# EAGLE schematic keyboard (EAGLE 9.6.1)

## Sheet 1 of 2: Key connections
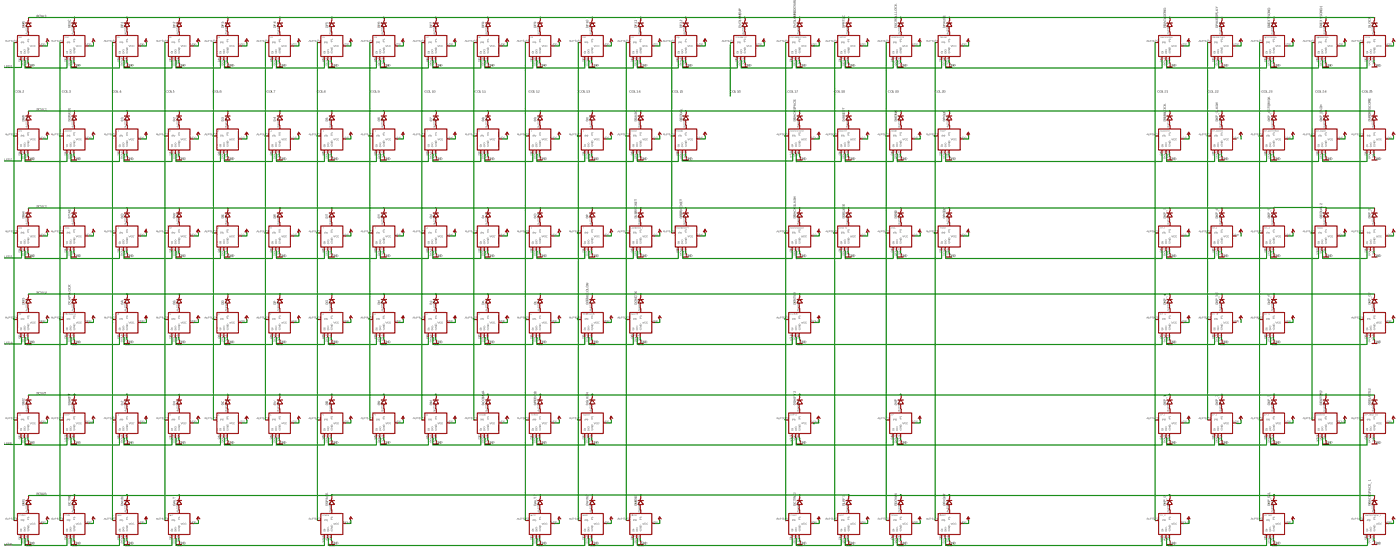
[diagram p0: schematic, sheet 1, overview]
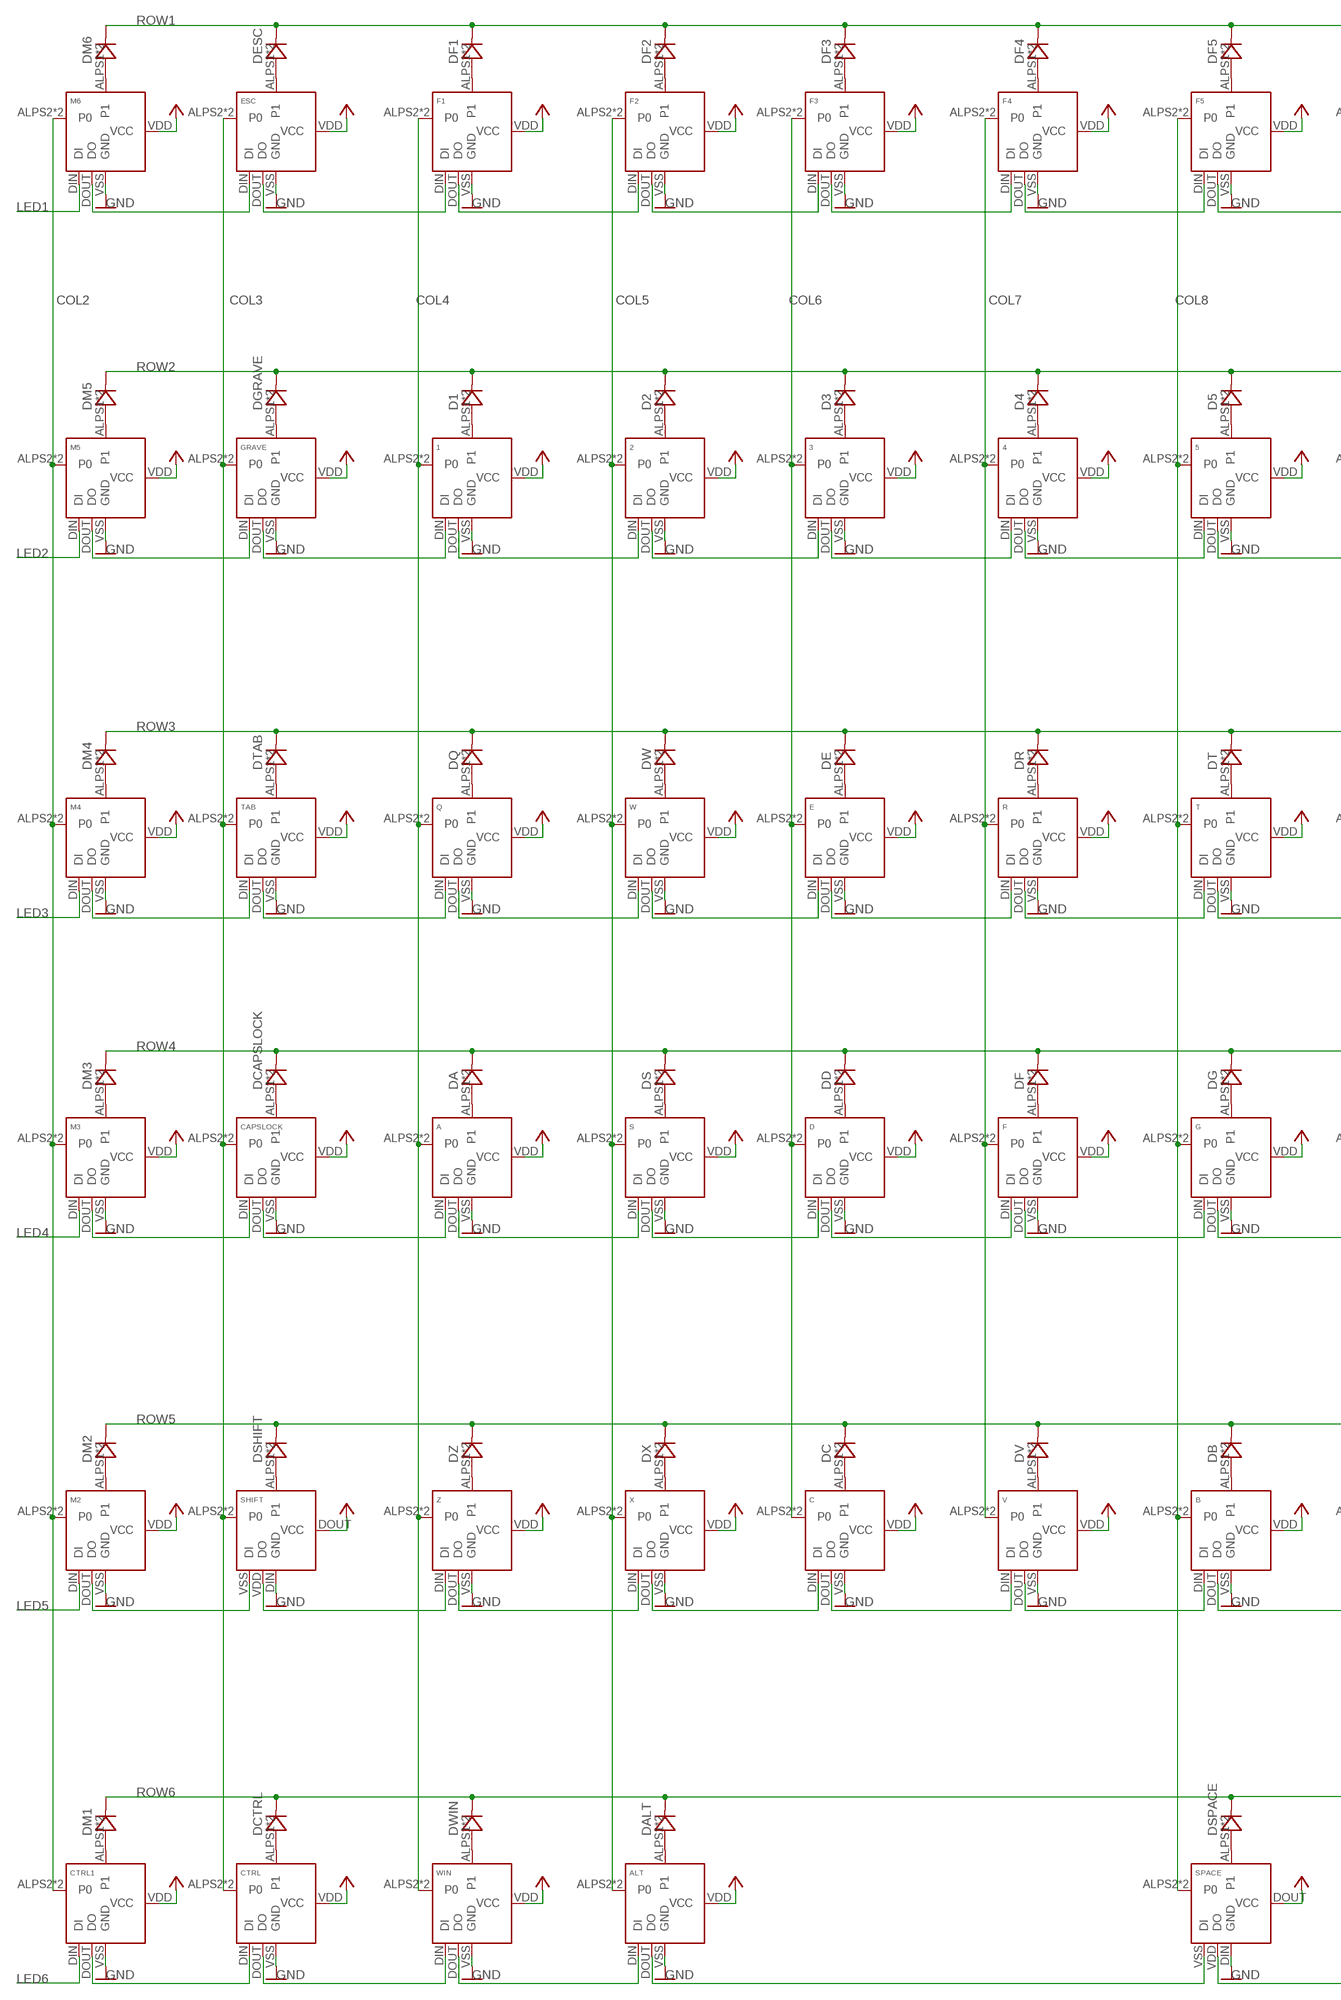
[diagram p1: schematic, sheet 1, part 1 of 4]
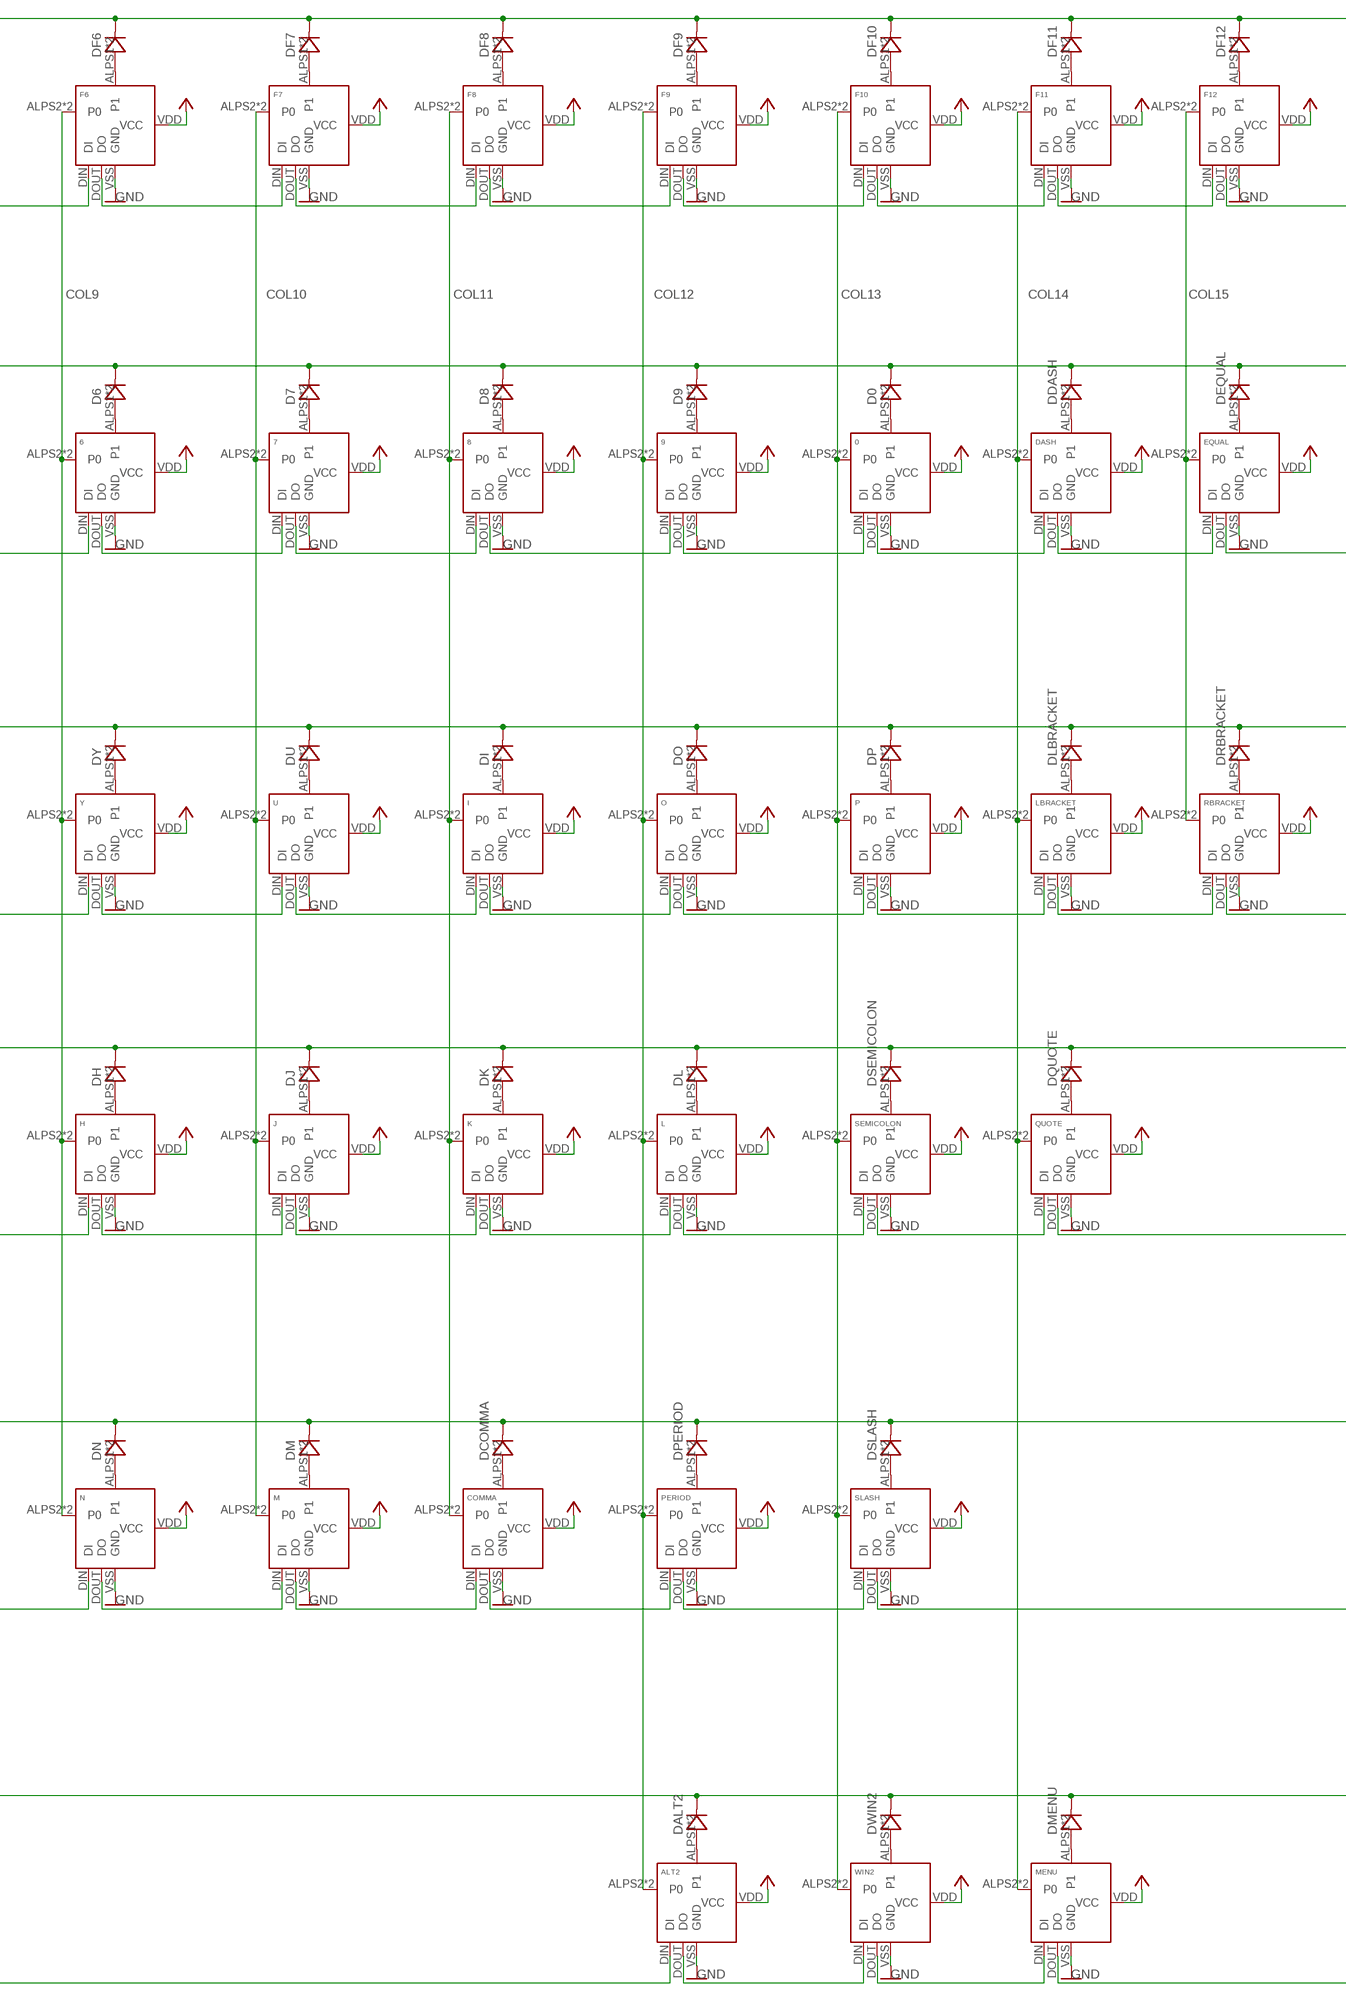
[diagram p2: schematic, sheet 1, part 2 of 4]
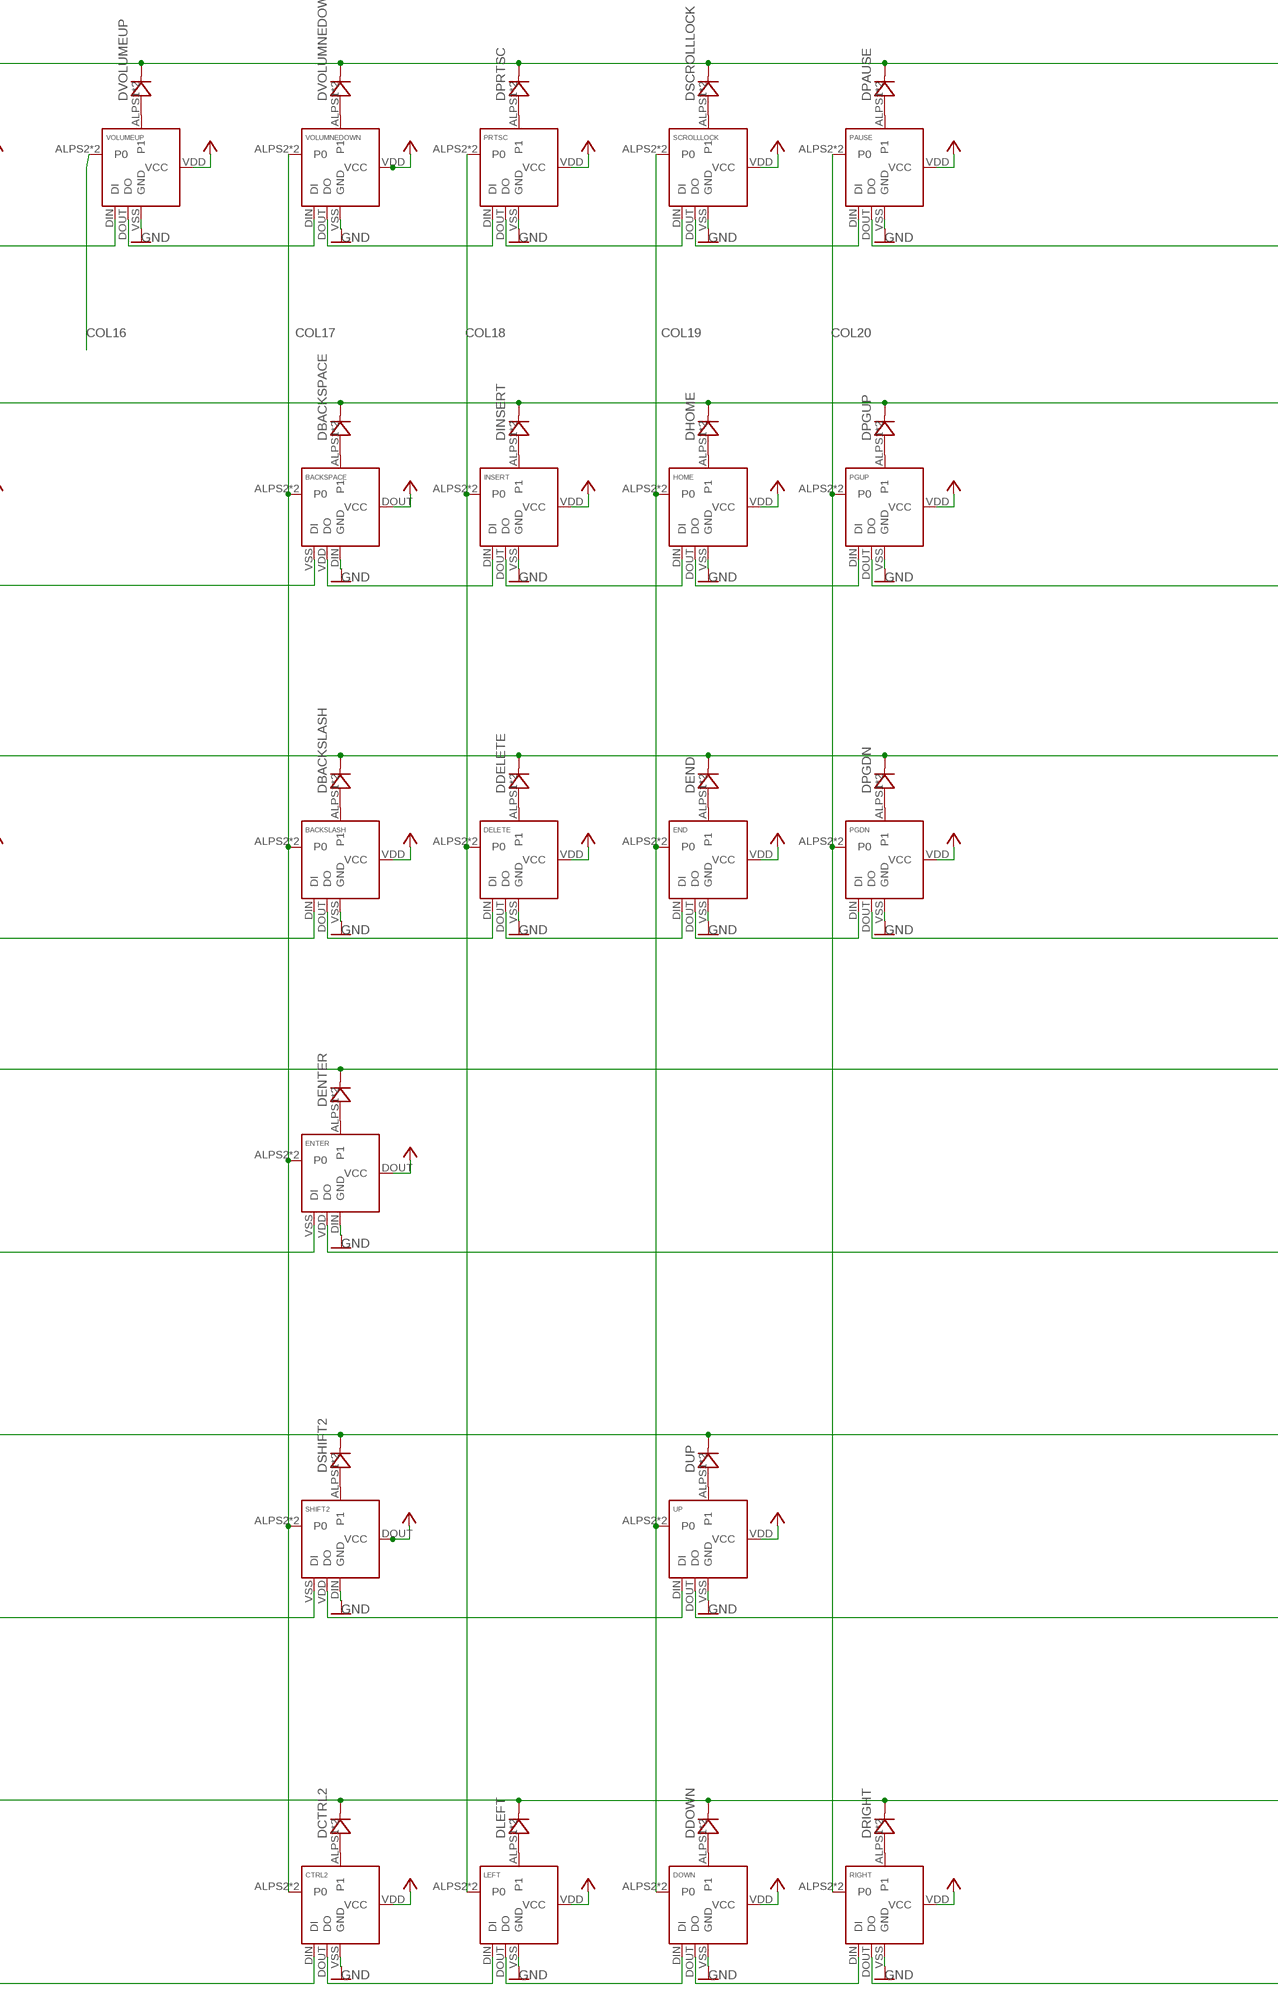
[diagram p3: schematic, sheet 1, part 3 of 4]
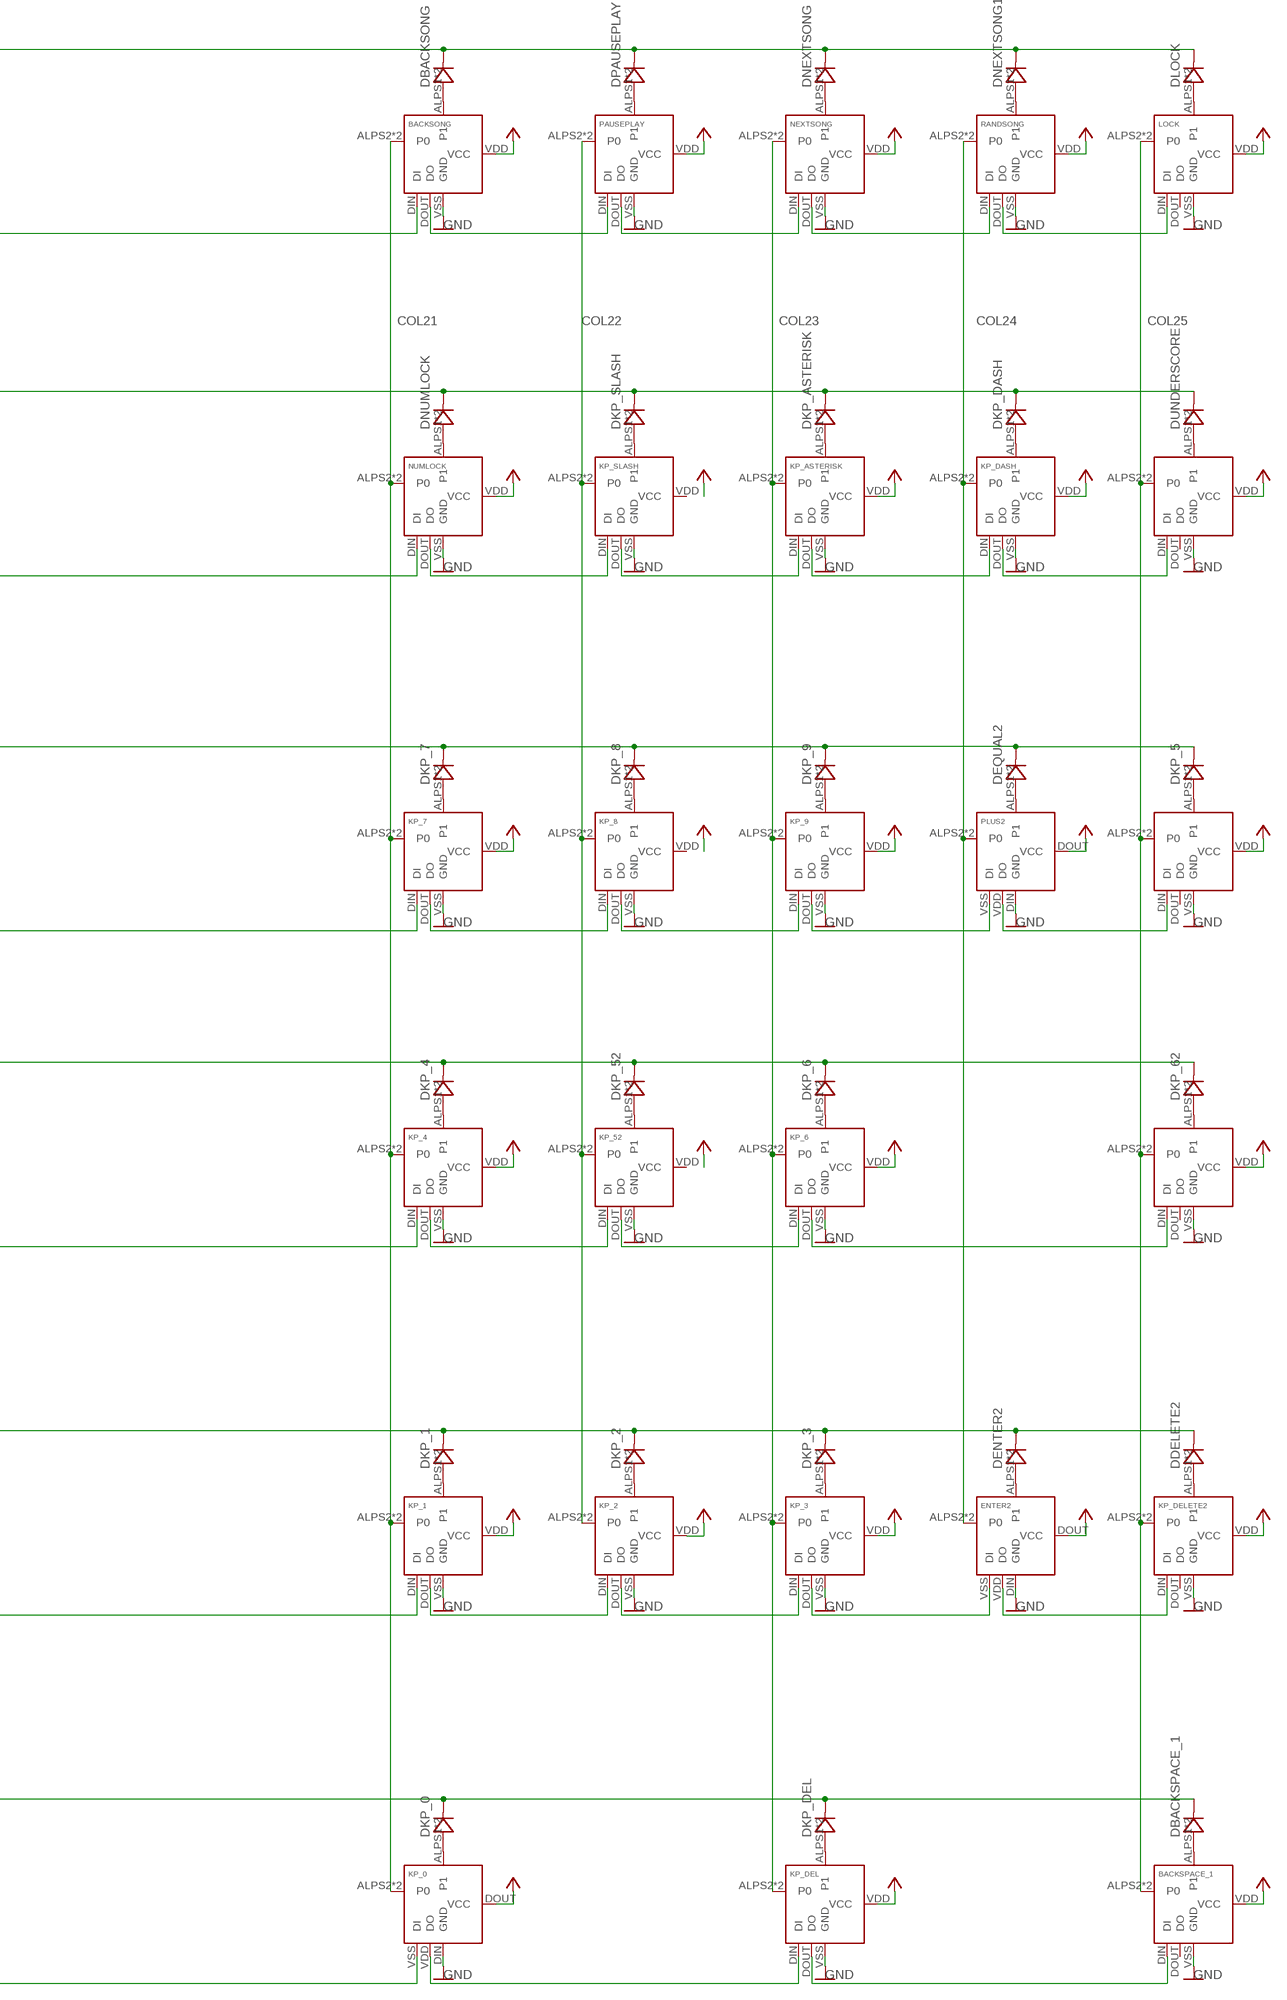
[diagram p4: schematic, sheet 1, part 4 of 4]

### Parts
0  KEYSWITCH-RGBSMDLED-ALPSMX-1U-SMDRGB  [ALPSMX-1U-SMDRGB]
1  KEYSWITCH-RGBSMDLED-ALPSMX-1U-SMDRGB  [ALPSMX-1U-SMDRGB]
2  KEYSWITCH-RGBSMDLED-ALPSMX-1U-SMDRGB  [ALPSMX-1U-SMDRGB]
3  KEYSWITCH-RGBSMDLED-ALPSMX-1U-SMDRGB  [ALPSMX-1U-SMDRGB]
4  KEYSWITCH-RGBSMDLED-ALPSMX-1U-SMDRGB  [ALPSMX-1U-SMDRGB]
5  KEYSWITCH-RGBSMDLED-ALPSMX-1U-SMDRGB  [ALPSMX-1U-SMDRGB]
6  KEYSWITCH-RGBSMDLED-ALPSMX-1U-SMDRGB  [ALPSMX-1U-SMDRGB]
7  KEYSWITCH-RGBSMDLED-ALPSMX-1U-SMDRGB  [ALPSMX-1U-SMDRGB]
8  KEYSWITCH-RGBSMDLED-ALPSMX-1U-SMDRGB  [ALPSMX-1U-SMDRGB]
9  KEYSWITCH-RGBSMDLED-ALPSMX-1U-SMDRGB  [ALPSMX-1U-SMDRGB]
A  KEYSWITCH-RGBSMDLED-ALPSMX-1U-SMDRGB  [ALPSMX-1U-SMDRGB]
ALT  KEYSWITCH-RGBSMDLED-ALPSMX-1U-SMDRGB  [ALPSMX-1U-SMDRGB]
ALT2  KEYSWITCH-RGBSMDLED-ALPSMX-1U-SMDRGB  [ALPSMX-1U-SMDRGB]
B  KEYSWITCH-RGBSMDLED-ALPSMX-1U-SMDRGB  [ALPSMX-1U-SMDRGB]
BACKSLASH  KEYSWITCH-RGBSMDLED-ALPSMX-1U-SMDRGB  [ALPSMX-1U-SMDRGB]
BACKSONG  KEYSWITCH-RGBSMDLED-ALPSMX-1U-SMDRGB  [ALPSMX-1U-SMDRGB]
BACKSPACE  KEYSWITCH-RGBSMDLED-ALPSMX-2U-SMDRGB  [ALPSMX-2U-SMDRGB]
BACKSPACE_1  KEYSWITCH-RGBSMDLED-ALPSMX-1U-SMDRGB  [ALPSMX-1U-SMDRGB]
C  KEYSWITCH-RGBSMDLED-ALPSMX-1U-SMDRGB  [ALPSMX-1U-SMDRGB]
CAPSLOCK  KEYSWITCH-RGBSMDLED-ALPSMX-1U-SMDRGB  [ALPSMX-1U-SMDRGB]
COMMA  KEYSWITCH-RGBSMDLED-ALPSMX-1U-SMDRGB  [ALPSMX-1U-SMDRGB]
CTRL  KEYSWITCH-RGBSMDLED-ALPSMX-1U-SMDRGB  [ALPSMX-1U-SMDRGB]
CTRL1  KEYSWITCH-RGBSMDLED-ALPSMX-1U-SMDRGB  [ALPSMX-1U-SMDRGB]
CTRL2  KEYSWITCH-RGBSMDLED-ALPSMX-1U-SMDRGB  [ALPSMX-1U-SMDRGB]
D  KEYSWITCH-RGBSMDLED-ALPSMX-1U-SMDRGB  [ALPSMX-1U-SMDRGB]
D0  DIODE-SOD-123  [SOD-123]
D1  DIODE-SOD-123  [SOD-123]
D2  DIODE-SOD-123  [SOD-123]
D3  DIODE-SOD-123  [SOD-123]
D4  DIODE-SOD-123  [SOD-123]
D5  DIODE-SOD-123  [SOD-123]
D6  DIODE-SOD-123  [SOD-123]
D7  DIODE-SOD-123  [SOD-123]
D8  DIODE-SOD-123  [SOD-123]
D9  DIODE-SOD-123  [SOD-123]
DA  DIODE-SOD-123  [SOD-123]
DALT  DIODE-SOD-123  [SOD-123]
DALT2  DIODE-SOD-123  [SOD-123]
DASH  KEYSWITCH-RGBSMDLED-ALPSMX-1U-SMDRGB  [ALPSMX-1U-SMDRGB]
DB  DIODE-SOD-123  [SOD-123]
DBACKSLASH  DIODE-SOD-123  [SOD-123]
DBACKSONG  DIODE-SOD-123  [SOD-123]
DBACKSPACE  DIODE-SOD-123  [SOD-123]
DBACKSPACE_1  DIODE-SOD-123  [SOD-123]
DC  DIODE-SOD-123  [SOD-123]
DCAPSLOCK  DIODE-SOD-123  [SOD-123]
DCOMMA  DIODE-SOD-123  [SOD-123]
DCTRL  DIODE-SOD-123  [SOD-123]
DCTRL2  DIODE-SOD-123  [SOD-123]
DD  DIODE-SOD-123  [SOD-123]
DDASH  DIODE-SOD-123  [SOD-123]
DDELETE  DIODE-SOD-123  [SOD-123]
DDELETE2  DIODE-SOD-123  [SOD-123]
DDOWN  DIODE-SOD-123  [SOD-123]
DE  DIODE-SOD-123  [SOD-123]
DELETE  KEYSWITCH-RGBSMDLED-ALPSMX-1U-SMDRGB  [ALPSMX-1U-SMDRGB]
DEND  DIODE-SOD-123  [SOD-123]
DENTER  DIODE-SOD-123  [SOD-123]
DENTER2  DIODE-SOD-123  [SOD-123]
DEQUAL  DIODE-SOD-123  [SOD-123]
DEQUAL2  DIODE-SOD-123  [SOD-123]
DESC  DIODE-SOD-123  [SOD-123]
DF  DIODE-SOD-123  [SOD-123]
DF1  DIODE-SOD-123  [SOD-123]
DF2  DIODE-SOD-123  [SOD-123]
DF3  DIODE-SOD-123  [SOD-123]
DF4  DIODE-SOD-123  [SOD-123]
DF5  DIODE-SOD-123  [SOD-123]
DF6  DIODE-SOD-123  [SOD-123]
DF7  DIODE-SOD-123  [SOD-123]
DF8  DIODE-SOD-123  [SOD-123]
DF9  DIODE-SOD-123  [SOD-123]
DF10  DIODE-SOD-123  [SOD-123]
DF11  DIODE-SOD-123  [SOD-123]
DF12  DIODE-SOD-123  [SOD-123]
DG  DIODE-SOD-123  [SOD-123]
DGRAVE  DIODE-SOD-123  [SOD-123]
DH  DIODE-SOD-123  [SOD-123]
DHOME  DIODE-SOD-123  [SOD-123]
DI  DIODE-SOD-123  [SOD-123]
DINSERT  DIODE-SOD-123  [SOD-123]
DJ  DIODE-SOD-123  [SOD-123]
DK  DIODE-SOD-123  [SOD-123]
DKP_0  DIODE-SOD-123  [SOD-123]
DKP_1  DIODE-SOD-123  [SOD-123]
DKP_2  DIODE-SOD-123  [SOD-123]
DKP_3  DIODE-SOD-123  [SOD-123]
DKP_4  DIODE-SOD-123  [SOD-123]
DKP_5  DIODE-SOD-123  [SOD-123]
DKP_6  DIODE-SOD-123  [SOD-123]
DKP_7  DIODE-SOD-123  [SOD-123]
DKP_8  DIODE-SOD-123  [SOD-123]
DKP_9  DIODE-SOD-123  [SOD-123]
DKP_52  DIODE-SOD-123  [SOD-123]
DKP_62  DIODE-SOD-123  [SOD-123]
DKP_ASTERISK  DIODE-SOD-123  [SOD-123]
DKP_DASH  DIODE-SOD-123  [SOD-123]
DKP_DEL  DIODE-SOD-123  [SOD-123]
DKP_SLASH  DIODE-SOD-123  [SOD-123]
DL  DIODE-SOD-123  [SOD-123]
DLBRACKET  DIODE-SOD-123  [SOD-123]
DLEFT  DIODE-SOD-123  [SOD-123]
DLOCK  DIODE-SOD-123  [SOD-123]
DM  DIODE-SOD-123  [SOD-123]
DM1  DIODE-SOD-123  [SOD-123]
DM2  DIODE-SOD-123  [SOD-123]
DM3  DIODE-SOD-123  [SOD-123]
DM4  DIODE-SOD-123  [SOD-123]
DM5  DIODE-SOD-123  [SOD-123]
DM6  DIODE-SOD-123  [SOD-123]
DMENU  DIODE-SOD-123  [SOD-123]
DN  DIODE-SOD-123  [SOD-123]
DNEXTSONG  DIODE-SOD-123  [SOD-123]
DNEXTSONG1  DIODE-SOD-123  [SOD-123]
DNUMLOCK  DIODE-SOD-123  [SOD-123]
DO  DIODE-SOD-123  [SOD-123]
DOWN  KEYSWITCH-RGBSMDLED-ALPSMX-1U-SMDRGB  [ALPSMX-1U-SMDRGB]
DP  DIODE-SOD-123  [SOD-123]
DPAUSE  DIODE-SOD-123  [SOD-123]
DPAUSEPLAY  DIODE-SOD-123  [SOD-123]
DPERIOD  DIODE-SOD-123  [SOD-123]
DPGDN  DIODE-SOD-123  [SOD-123]
DPGUP  DIODE-SOD-123  [SOD-123]
DPRTSC  DIODE-SOD-123  [SOD-123]
DQ  DIODE-SOD-123  [SOD-123]
DQUOTE  DIODE-SOD-123  [SOD-123]
DR  DIODE-SOD-123  [SOD-123]
DRBRACKET  DIODE-SOD-123  [SOD-123]
DRIGHT  DIODE-SOD-123  [SOD-123]
DS  DIODE-SOD-123  [SOD-123]
DSCROLLLOCK  DIODE-SOD-123  [SOD-123]
DSEMICOLON  DIODE-SOD-123  [SOD-123]
DSHIFT  DIODE-SOD-123  [SOD-123]
DSHIFT2  DIODE-SOD-123  [SOD-123]
DSLASH  DIODE-SOD-123  [SOD-123]
DSPACE  DIODE-SOD-123  [SOD-123]
DT  DIODE-SOD-123  [SOD-123]
DTAB  DIODE-SOD-123  [SOD-123]
DU  DIODE-SOD-123  [SOD-123]
DUNDERSCORE  DIODE-SOD-123  [SOD-123]
DUP  DIODE-SOD-123  [SOD-123]
DV  DIODE-SOD-123  [SOD-123]
DVOLUMEUP  DIODE-SOD-123  [SOD-123]
DVOLUMNEDOWN  DIODE-SOD-123  [SOD-123]
DW  DIODE-SOD-123  [SOD-123]
DWIN  DIODE-SOD-123  [SOD-123]
DWIN2  DIODE-SOD-123  [SOD-123]
DX  DIODE-SOD-123  [SOD-123]
DY  DIODE-SOD-123  [SOD-123]
DZ  DIODE-SOD-123  [SOD-123]
E  KEYSWITCH-RGBSMDLED-ALPSMX-1U-SMDRGB  [ALPSMX-1U-SMDRGB]
END  KEYSWITCH-RGBSMDLED-ALPSMX-1U-SMDRGB  [ALPSMX-1U-SMDRGB]
ENTER  KEYSWITCH-RGBSMDLED-ALPSMX-2U-SMDRGB  [ALPSMX-2U-SMDRGB]
ENTER2  KEYSWITCH-RGBSMDLED-ALPSMX-2U-SMDRGB-ROTATED  [ALPSMX-2U-SMDRGB-ROTATED]
EQUAL  KEYSWITCH-RGBSMDLED-ALPSMX-1U-SMDRGB  [ALPSMX-1U-SMDRGB]
ESC  KEYSWITCH-RGBSMDLED-ALPSMX-1U-SMDRGB  [ALPSMX-1U-SMDRGB]
F  KEYSWITCH-RGBSMDLED-ALPSMX-1U-SMDRGB  [ALPSMX-1U-SMDRGB]
F1  KEYSWITCH-RGBSMDLED-ALPSMX-1U-SMDRGB  [ALPSMX-1U-SMDRGB]
F2  KEYSWITCH-RGBSMDLED-ALPSMX-1U-SMDRGB  [ALPSMX-1U-SMDRGB]
F3  KEYSWITCH-RGBSMDLED-ALPSMX-1U-SMDRGB  [ALPSMX-1U-SMDRGB]
F4  KEYSWITCH-RGBSMDLED-ALPSMX-1U-SMDRGB  [ALPSMX-1U-SMDRGB]
F5  KEYSWITCH-RGBSMDLED-ALPSMX-1U-SMDRGB  [ALPSMX-1U-SMDRGB]
F6  KEYSWITCH-RGBSMDLED-ALPSMX-1U-SMDRGB  [ALPSMX-1U-SMDRGB]
F7  KEYSWITCH-RGBSMDLED-ALPSMX-1U-SMDRGB  [ALPSMX-1U-SMDRGB]
F8  KEYSWITCH-RGBSMDLED-ALPSMX-1U-SMDRGB  [ALPSMX-1U-SMDRGB]
F9  KEYSWITCH-RGBSMDLED-ALPSMX-1U-SMDRGB  [ALPSMX-1U-SMDRGB]
F10  KEYSWITCH-RGBSMDLED-ALPSMX-1U-SMDRGB  [ALPSMX-1U-SMDRGB]
F11  KEYSWITCH-RGBSMDLED-ALPSMX-1U-SMDRGB  [ALPSMX-1U-SMDRGB]
F12  KEYSWITCH-RGBSMDLED-ALPSMX-1U-SMDRGB  [ALPSMX-1U-SMDRGB]
G  KEYSWITCH-RGBSMDLED-ALPSMX-1U-SMDRGB  [ALPSMX-1U-SMDRGB]
GRAVE  KEYSWITCH-RGBSMDLED-ALPSMX-1U-SMDRGB  [ALPSMX-1U-SMDRGB]
H  KEYSWITCH-RGBSMDLED-ALPSMX-1U-SMDRGB  [ALPSMX-1U-SMDRGB]
HOME  KEYSWITCH-RGBSMDLED-ALPSMX-1U-SMDRGB  [ALPSMX-1U-SMDRGB]
I  KEYSWITCH-RGBSMDLED-ALPSMX-1U-SMDRGB  [ALPSMX-1U-SMDRGB]
INSERT  KEYSWITCH-RGBSMDLED-ALPSMX-1U-SMDRGB  [ALPSMX-1U-SMDRGB]
J  KEYSWITCH-RGBSMDLED-ALPSMX-1U-SMDRGB  [ALPSMX-1U-SMDRGB]
K  KEYSWITCH-RGBSMDLED-ALPSMX-1U-SMDRGB  [ALPSMX-1U-SMDRGB]
KP_0  KEYSWITCH-RGBSMDLED-ALPSMX-2U-SMDRGB  [ALPSMX-2U-SMDRGB]
KP_1  KEYSWITCH-RGBSMDLED-ALPSMX-1U-SMDRGB  [ALPSMX-1U-SMDRGB]
KP_2  KEYSWITCH-RGBSMDLED-ALPSMX-1U-SMDRGB  [ALPSMX-1U-SMDRGB]
KP_3  KEYSWITCH-RGBSMDLED-ALPSMX-1U-SMDRGB  [ALPSMX-1U-SMDRGB]
KP_4  KEYSWITCH-RGBSMDLED-ALPSMX-1U-SMDRGB  [ALPSMX-1U-SMDRGB]
KP_5  KEYSWITCH-RGBSMDLED-ALPSMX-1U-SMDRGB  [ALPSMX-1U-SMDRGB]
KP_6  KEYSWITCH-RGBSMDLED-ALPSMX-1U-SMDRGB  [ALPSMX-1U-SMDRGB]
KP_7  KEYSWITCH-RGBSMDLED-ALPSMX-1U-SMDRGB  [ALPSMX-1U-SMDRGB]
KP_8  KEYSWITCH-RGBSMDLED-ALPSMX-1U-SMDRGB  [ALPSMX-1U-SMDRGB]
KP_9  KEYSWITCH-RGBSMDLED-ALPSMX-1U-SMDRGB  [ALPSMX-1U-SMDRGB]
KP_52  KEYSWITCH-RGBSMDLED-ALPSMX-1U-SMDRGB  [ALPSMX-1U-SMDRGB]
KP_62  KEYSWITCH-RGBSMDLED-ALPSMX-1U-SMDRGB  [ALPSMX-1U-SMDRGB]
KP_ASTERISK  KEYSWITCH-RGBSMDLED-ALPSMX-1U-SMDRGB  [ALPSMX-1U-SMDRGB]
KP_DASH  KEYSWITCH-RGBSMDLED-ALPSMX-1U-SMDRGB  [ALPSMX-1U-SMDRGB]
KP_DEL  KEYSWITCH-RGBSMDLED-ALPSMX-1U-SMDRGB  [ALPSMX-1U-SMDRGB]
KP_DELETE2  KEYSWITCH-RGBSMDLED-ALPSMX-1U-SMDRGB  [ALPSMX-1U-SMDRGB]
KP_SLASH  KEYSWITCH-RGBSMDLED-ALPSMX-1U-SMDRGB  [ALPSMX-1U-SMDRGB]
L  KEYSWITCH-RGBSMDLED-ALPSMX-1U-SMDRGB  [ALPSMX-1U-SMDRGB]
LBRACKET  KEYSWITCH-RGBSMDLED-ALPSMX-1U-SMDRGB  [ALPSMX-1U-SMDRGB]
LEFT  KEYSWITCH-RGBSMDLED-ALPSMX-1U-SMDRGB  [ALPSMX-1U-SMDRGB]
LOCK  KEYSWITCH-RGBSMDLED-ALPSMX-1U-SMDRGB  [ALPSMX-1U-SMDRGB]
M  KEYSWITCH-RGBSMDLED-ALPSMX-1U-SMDRGB  [ALPSMX-1U-SMDRGB]
M2  KEYSWITCH-RGBSMDLED-ALPSMX-1U-SMDRGB  [ALPSMX-1U-SMDRGB]
M3  KEYSWITCH-RGBSMDLED-ALPSMX-1U-SMDRGB  [ALPSMX-1U-SMDRGB]
M4  KEYSWITCH-RGBSMDLED-ALPSMX-1U-SMDRGB  [ALPSMX-1U-SMDRGB]
M5  KEYSWITCH-RGBSMDLED-ALPSMX-1U-SMDRGB  [ALPSMX-1U-SMDRGB]
M6  KEYSWITCH-RGBSMDLED-ALPSMX-1U-SMDRGB  [ALPSMX-1U-SMDRGB]
MENU  KEYSWITCH-RGBSMDLED-ALPSMX-1U-SMDRGB  [ALPSMX-1U-SMDRGB]
N  KEYSWITCH-RGBSMDLED-ALPSMX-1U-SMDRGB  [ALPSMX-1U-SMDRGB]
NEXTSONG  KEYSWITCH-RGBSMDLED-ALPSMX-1U-SMDRGB  [ALPSMX-1U-SMDRGB]
NUMLOCK  KEYSWITCH-RGBSMDLED-ALPSMX-1U-SMDRGB  [ALPSMX-1U-SMDRGB]
O  KEYSWITCH-RGBSMDLED-ALPSMX-1U-SMDRGB  [ALPSMX-1U-SMDRGB]
P  KEYSWITCH-RGBSMDLED-ALPSMX-1U-SMDRGB  [ALPSMX-1U-SMDRGB]
PAUSE  KEYSWITCH-RGBSMDLED-ALPSMX-1U-SMDRGB  [ALPSMX-1U-SMDRGB]
PAUSEPLAY  KEYSWITCH-RGBSMDLED-ALPSMX-1U-SMDRGB  [ALPSMX-1U-SMDRGB]
PERIOD  KEYSWITCH-RGBSMDLED-ALPSMX-1U-SMDRGB  [ALPSMX-1U-SMDRGB]
PGDN  KEYSWITCH-RGBSMDLED-ALPSMX-1U-SMDRGB  [ALPSMX-1U-SMDRGB]
PGUP  KEYSWITCH-RGBSMDLED-ALPSMX-1U-SMDRGB  [ALPSMX-1U-SMDRGB]
PLUS2  KEYSWITCH-RGBSMDLED-ALPSMX-2U-SMDRGB-ROTATED  [ALPSMX-2U-SMDRGB-ROTATED]
PRTSC  KEYSWITCH-RGBSMDLED-ALPSMX-1U-SMDRGB  [ALPSMX-1U-SMDRGB]
Q  KEYSWITCH-RGBSMDLED-ALPSMX-1U-SMDRGB  [ALPSMX-1U-SMDRGB]
QUOTE  KEYSWITCH-RGBSMDLED-ALPSMX-1U-SMDRGB  [ALPSMX-1U-SMDRGB]
R  KEYSWITCH-RGBSMDLED-ALPSMX-1U-SMDRGB  [ALPSMX-1U-SMDRGB]
RANDSONG  KEYSWITCH-RGBSMDLED-ALPSMX-1U-SMDRGB  [ALPSMX-1U-SMDRGB]
RBRACKET  KEYSWITCH-RGBSMDLED-ALPSMX-1U-SMDRGB  [ALPSMX-1U-SMDRGB]
RIGHT  KEYSWITCH-RGBSMDLED-ALPSMX-1U-SMDRGB  [ALPSMX-1U-SMDRGB]
S  KEYSWITCH-RGBSMDLED-ALPSMX-1U-SMDRGB  [ALPSMX-1U-SMDRGB]
SCROLLLOCK  KEYSWITCH-RGBSMDLED-ALPSMX-1U-SMDRGB  [ALPSMX-1U-SMDRGB]
SEMICOLON  KEYSWITCH-RGBSMDLED-ALPSMX-1U-SMDRGB  [ALPSMX-1U-SMDRGB]
SHIFT  KEYSWITCH-RGBSMDLED-ALPSMX-2U-SMDRGB  [ALPSMX-2U-SMDRGB]
SHIFT2  KEYSWITCH-RGBSMDLED-ALPSMX-2U-SMDRGB  [ALPSMX-2U-SMDRGB]
SLASH  KEYSWITCH-RGBSMDLED-ALPSMX-1U-SMDRGB  [ALPSMX-1U-SMDRGB]
SPACE  KEYSWITCH-RGBSMDLED-ALPSMX-6.25U-SMDRGB  [ALPSMX-6.25U-SMDRGB]
T  KEYSWITCH-RGBSMDLED-ALPSMX-1U-SMDRGB  [ALPSMX-1U-SMDRGB]
TAB  KEYSWITCH-RGBSMDLED-ALPSMX-1U-SMDRGB  [ALPSMX-1U-SMDRGB]
U  KEYSWITCH-RGBSMDLED-ALPSMX-1U-SMDRGB  [ALPSMX-1U-SMDRGB]
UNDERSCORE  KEYSWITCH-RGBSMDLED-ALPSMX-1U-SMDRGB  [ALPSMX-1U-SMDRGB]
UP  KEYSWITCH-RGBSMDLED-ALPSMX-1U-SMDRGB  [ALPSMX-1U-SMDRGB]
V  KEYSWITCH-RGBSMDLED-ALPSMX-1U-SMDRGB  [ALPSMX-1U-SMDRGB]
VOLUMEUP  KEYSWITCH-RGBSMDLED-ALPSMX-1U-SMDRGB  [ALPSMX-1U-SMDRGB]
VOLUMNEDOWN  KEYSWITCH-RGBSMDLED-ALPSMX-1U-SMDRGB  [ALPSMX-1U-SMDRGB]
W  KEYSWITCH-RGBSMDLED-ALPSMX-1U-SMDRGB  [ALPSMX-1U-SMDRGB]
WIN  KEYSWITCH-RGBSMDLED-ALPSMX-1U-SMDRGB  [ALPSMX-1U-SMDRGB]
WIN2  KEYSWITCH-RGBSMDLED-ALPSMX-1U-SMDRGB  [ALPSMX-1U-SMDRGB]
X  KEYSWITCH-RGBSMDLED-ALPSMX-1U-SMDRGB  [ALPSMX-1U-SMDRGB]
Y  KEYSWITCH-RGBSMDLED-ALPSMX-1U-SMDRGB  [ALPSMX-1U-SMDRGB]
Z  KEYSWITCH-RGBSMDLED-ALPSMX-1U-SMDRGB  [ALPSMX-1U-SMDRGB]

### Nets
+5V [POWER]: 0.VDD(VCC) 1.VDD(VCC) 2.VDD(VCC) 3.VDD(VCC) 4.VDD(VCC) 5.VDD(VCC) 6.VDD(VCC) 7.VDD(VCC) 8.VDD(VCC) 9.VDD(VCC) A.VDD(VCC) ALT2.VDD(VCC) ALT.VDD(VCC) B.VDD(VCC) BACKSONG.VDD(VCC) BACKSPACE_1.VDD(VCC) C.VDD(VCC) CAPSLOCK.VDD(VCC) COMMA.VDD(VCC) CTRL1.VDD(VCC) CTRL.VDD(VCC) D.VDD(VCC) DASH.VDD(VCC) DELETE.VDD(VCC) DOWN.VDD(VCC) E.VDD(VCC) END.VDD(VCC) ENTER2.DOUT(VCC) EQUAL.VDD(VCC) ESC.VDD(VCC) F1.VDD(VCC) F2.VDD(VCC) F3.VDD(VCC) F4.VDD(VCC) F5.VDD(VCC) F6.VDD(VCC) F7.VDD(VCC) F8.VDD(VCC) F9.VDD(VCC) F10.VDD(VCC) F11.VDD(VCC) F12.VDD(VCC) F.VDD(VCC) G.VDD(VCC) GRAVE.VDD(VCC) H.VDD(VCC) HOME.VDD(VCC) I.VDD(VCC) INSERT.VDD(VCC) J.VDD(VCC) K.VDD(VCC) KP_0.DOUT(VCC) KP_1.VDD(VCC) KP_2.VDD(VCC) KP_3.VDD(VCC) KP_4.VDD(VCC) KP_5.VDD(VCC) KP_6.VDD(VCC) KP_7.VDD(VCC) KP_9.VDD(VCC) KP_62.VDD(VCC) KP_ASTERISK.VDD(VCC) KP_DASH.VDD(VCC) KP_DEL.VDD(VCC) KP_DELETE2.VDD(VCC) L.VDD(VCC) LBRACKET.VDD(VCC) LEFT.VDD(VCC) LOCK.VDD(VCC) M2.VDD(VCC) M3.VDD(VCC) M4.VDD(VCC) M5.VDD(VCC) M6.VDD(VCC) M.VDD(VCC) MENU.VDD(VCC) N.VDD(VCC) NEXTSONG.VDD(VCC) NUMLOCK.VDD(VCC) O.VDD(VCC) P.VDD(VCC) PAUSE.VDD(VCC) PAUSEPLAY.VDD(VCC) PERIOD.VDD(VCC) PGDN.VDD(VCC) PGUP.VDD(VCC) PLUS2.DOUT(VCC) PRTSC.VDD(VCC) Q.VDD(VCC) QUOTE.VDD(VCC) R.VDD(VCC) RANDSONG.VDD(VCC) RBRACKET.VDD(VCC) RIGHT.VDD(VCC) S.VDD(VCC) SCROLLLOCK.VDD(VCC) SEMICOLON.VDD(VCC) SHIFT2.DOUT(VCC) SHIFT.DOUT(VCC) SLASH.VDD(VCC) SPACE.DOUT(VCC) T.VDD(VCC) TAB.VDD(VCC) U.VDD(VCC) UNDERSCORE.VDD(VCC) UP.VDD(VCC) V.VDD(VCC) VOLUMEUP.VDD(VCC) VOLUMNEDOWN.VDD(VCC) W.VDD(VCC) WIN2.VDD(VCC) WIN.VDD(VCC) X.VDD(VCC) Y.VDD(VCC) Z.VDD(VCC) ; also sheet 2
COL2: CTRL1.ALPS2(P0) CTRL1.MX2(P0) M2.ALPS2(P0) M2.MX2(P0) M3.ALPS2(P0) M3.MX2(P0) M4.ALPS2(P0) M4.MX2(P0) M5.ALPS2(P0) M5.MX2(P0) M6.ALPS2(P0) M6.MX2(P0) ; also sheet 2
COL3: CAPSLOCK.ALPS2(P0) CAPSLOCK.MX2(P0) CTRL.ALPS2(P0) CTRL.MX2(P0) ESC.ALPS2(P0) ESC.MX2(P0) GRAVE.ALPS2(P0) GRAVE.MX2(P0) SHIFT.ALPS2(P0) SHIFT.MX2(P0) TAB.ALPS2(P0) TAB.MX2(P0) ; also sheet 2
COL4: 1.ALPS2(P0) 1.MX2(P0) A.ALPS2(P0) A.MX2(P0) F1.ALPS2(P0) F1.MX2(P0) Q.ALPS2(P0) Q.MX2(P0) WIN.ALPS2(P0) WIN.MX2(P0) Z.ALPS2(P0) Z.MX2(P0) ; also sheet 2
COL5: 2.ALPS2(P0) 2.MX2(P0) ALT.ALPS2(P0) ALT.MX2(P0) F2.ALPS2(P0) F2.MX2(P0) S.ALPS2(P0) S.MX2(P0) W.ALPS2(P0) W.MX2(P0) X.ALPS2(P0) X.MX2(P0) ; also sheet 2
COL6: 3.ALPS2(P0) 3.MX2(P0) C.ALPS2(P0) C.MX2(P0) D.ALPS2(P0) D.MX2(P0) E.ALPS2(P0) E.MX2(P0) F3.ALPS2(P0) F3.MX2(P0) ; also sheet 2
COL7: 4.ALPS2(P0) 4.MX2(P0) F4.ALPS2(P0) F4.MX2(P0) F.ALPS2(P0) F.MX2(P0) R.ALPS2(P0) R.MX2(P0) V.ALPS2(P0) V.MX2(P0) ; also sheet 2
COL8: 5.ALPS2(P0) 5.MX2(P0) B.ALPS2(P0) B.MX2(P0) F5.ALPS2(P0) F5.MX2(P0) G.ALPS2(P0) G.MX2(P0) SPACE.ALPS2(P0) SPACE.MX2(P0) T.ALPS2(P0) T.MX2(P0) ; also sheet 2
COL9: 6.ALPS2(P0) 6.MX2(P0) F6.ALPS2(P0) F6.MX2(P0) H.ALPS2(P0) H.MX2(P0) N.ALPS2(P0) N.MX2(P0) Y.ALPS2(P0) Y.MX2(P0) ; also sheet 2
COL10: 7.ALPS2(P0) 7.MX2(P0) F7.ALPS2(P0) F7.MX2(P0) J.ALPS2(P0) J.MX2(P0) M.ALPS2(P0) M.MX2(P0) U.ALPS2(P0) U.MX2(P0) ; also sheet 2
COL11: 8.ALPS2(P0) 8.MX2(P0) COMMA.ALPS2(P0) COMMA.MX2(P0) F8.ALPS2(P0) F8.MX2(P0) I.ALPS2(P0) I.MX2(P0) K.ALPS2(P0) K.MX2(P0) ; also sheet 2
COL12: 9.ALPS2(P0) 9.MX2(P0) ALT2.ALPS2(P0) ALT2.MX2(P0) F9.ALPS2(P0) F9.MX2(P0) L.ALPS2(P0) L.MX2(P0) O.ALPS2(P0) O.MX2(P0) PERIOD.ALPS2(P0) PERIOD.MX2(P0) ; also sheet 2
COL13: 0.ALPS2(P0) 0.MX2(P0) F10.ALPS2(P0) F10.MX2(P0) P.ALPS2(P0) P.MX2(P0) SEMICOLON.ALPS2(P0) SEMICOLON.MX2(P0) SLASH.ALPS2(P0) SLASH.MX2(P0) WIN2.ALPS2(P0) WIN2.MX2(P0) ; also sheet 2
COL14: DASH.ALPS2(P0) DASH.MX2(P0) F11.ALPS2(P0) F11.MX2(P0) LBRACKET.ALPS2(P0) LBRACKET.MX2(P0) MENU.ALPS2(P0) MENU.MX2(P0) QUOTE.ALPS2(P0) QUOTE.MX2(P0) ; also sheet 2
COL15: EQUAL.ALPS2(P0) EQUAL.MX2(P0) F12.ALPS2(P0) F12.MX2(P0) RBRACKET.ALPS2(P0) RBRACKET.MX2(P0) ; also sheet 2
COL16: VOLUMEUP.ALPS2(P0) VOLUMEUP.MX2(P0) ; also sheet 2
COL17: BACKSLASH.ALPS2(P0) BACKSLASH.MX2(P0) BACKSPACE.ALPS2(P0) BACKSPACE.MX2(P0) CTRL2.ALPS2(P0) CTRL2.MX2(P0) ENTER.ALPS2(P0) ENTER.MX2(P0) SHIFT2.ALPS2(P0) SHIFT2.MX2(P0) VOLUMNEDOWN.ALPS2(P0) VOLUMNEDOWN.MX2(P0) ; also sheet 2
COL18: DELETE.ALPS2(P0) DELETE.MX2(P0) INSERT.ALPS2(P0) INSERT.MX2(P0) LEFT.ALPS2(P0) LEFT.MX2(P0) PRTSC.ALPS2(P0) PRTSC.MX2(P0) ; also sheet 2
COL19: DOWN.ALPS2(P0) DOWN.MX2(P0) END.ALPS2(P0) END.MX2(P0) HOME.ALPS2(P0) HOME.MX2(P0) SCROLLLOCK.ALPS2(P0) SCROLLLOCK.MX2(P0) UP.ALPS2(P0) UP.MX2(P0) ; also sheet 2
COL20: PAUSE.ALPS2(P0) PAUSE.MX2(P0) PGDN.ALPS2(P0) PGDN.MX2(P0) PGUP.ALPS2(P0) PGUP.MX2(P0) RIGHT.ALPS2(P0) RIGHT.MX2(P0) ; also sheet 2
COL21: BACKSONG.ALPS2(P0) BACKSONG.MX2(P0) KP_0.ALPS2(P0) KP_0.MX2(P0) KP_1.ALPS2(P0) KP_1.MX2(P0) KP_4.ALPS2(P0) KP_4.MX2(P0) KP_7.ALPS2(P0) KP_7.MX2(P0) NUMLOCK.ALPS2(P0) NUMLOCK.MX2(P0) ; also sheet 2
COL22: KP_2.ALPS2(P0) KP_2.MX2(P0) KP_8.ALPS2(P0) KP_8.MX2(P0) KP_52.ALPS2(P0) KP_52.MX2(P0) KP_SLASH.ALPS2(P0) KP_SLASH.MX2(P0) PAUSEPLAY.ALPS2(P0) PAUSEPLAY.MX2(P0) ; also sheet 2
COL23: KP_3.ALPS2(P0) KP_3.MX2(P0) KP_6.ALPS2(P0) KP_6.MX2(P0) KP_9.ALPS2(P0) KP_9.MX2(P0) KP_ASTERISK.ALPS2(P0) KP_ASTERISK.MX2(P0) KP_DEL.ALPS2(P0) KP_DEL.MX2(P0) NEXTSONG.ALPS2(P0) NEXTSONG.MX2(P0) ; also sheet 2
COL24: ENTER2.ALPS2(P0) ENTER2.MX2(P0) KP_DASH.ALPS2(P0) KP_DASH.MX2(P0) PLUS2.ALPS2(P0) PLUS2.MX2(P0) RANDSONG.ALPS2(P0) RANDSONG.MX2(P0) ; also sheet 2
COL25: BACKSPACE_1.ALPS2(P0) BACKSPACE_1.MX2(P0) KP_5.ALPS2(P0) KP_5.MX2(P0) KP_62.ALPS2(P0) KP_62.MX2(P0) KP_DELETE2.ALPS2(P0) KP_DELETE2.MX2(P0) LOCK.ALPS2(P0) LOCK.MX2(P0) UNDERSCORE.ALPS2(P0) UNDERSCORE.MX2(P0) ; also sheet 2
GND [POWER]: 0.VSS(GND) 1.VSS(GND) 2.VSS(GND) 3.VSS(GND) 4.VSS(GND) 5.VSS(GND) 6.VSS(GND) 7.VSS(GND) 8.VSS(GND) 9.VSS(GND) A.VSS(GND) ALT2.VSS(GND) ALT.VSS(GND) B.VSS(GND) BACKSLASH.VSS(GND) BACKSONG.VSS(GND) BACKSPACE.DIN(GND) BACKSPACE_1.VSS(GND) C.VSS(GND) CAPSLOCK.VSS(GND) COMMA.VSS(GND) CTRL1.VSS(GND) CTRL2.VSS(GND) CTRL.VSS(GND) D.VSS(GND) DASH.VSS(GND) DELETE.VSS(GND) DOWN.VSS(GND) E.VSS(GND) END.VSS(GND) ENTER2.DIN(GND) ENTER.DIN(GND) EQUAL.VSS(GND) ESC.VSS(GND) F1.VSS(GND) F2.VSS(GND) F3.VSS(GND) F4.VSS(GND) F5.VSS(GND) F6.VSS(GND) F7.VSS(GND) F8.VSS(GND) F9.VSS(GND) F10.VSS(GND) F11.VSS(GND) F12.VSS(GND) F.VSS(GND) G.VSS(GND) GRAVE.VSS(GND) H.VSS(GND) HOME.VSS(GND) I.VSS(GND) INSERT.VSS(GND) J.VSS(GND) K.VSS(GND) KP_0.DIN(GND) KP_1.VSS(GND) KP_2.VSS(GND) KP_3.VSS(GND) KP_4.VSS(GND) KP_5.VSS(GND) KP_6.VSS(GND) KP_7.VSS(GND) KP_8.VSS(GND) KP_9.VSS(GND) KP_52.VSS(GND) KP_62.VSS(GND) KP_ASTERISK.VSS(GND) KP_DASH.VSS(GND) KP_DEL.VSS(GND) KP_DELETE2.VSS(GND) KP_SLASH.VSS(GND) L.VSS(GND) LBRACKET.VSS(GND) LEFT.VSS(GND) LOCK.VSS(GND) M2.VSS(GND) M3.VSS(GND) M4.VSS(GND) M5.VSS(GND) M6.VSS(GND) M.VSS(GND) MENU.VSS(GND) N.VSS(GND) NEXTSONG.VSS(GND) NUMLOCK.VSS(GND) O.VSS(GND) P.VSS(GND) PAUSE.VSS(GND) PAUSEPLAY.VSS(GND) PERIOD.VSS(GND) PGDN.VSS(GND) PGUP.VSS(GND) PLUS2.DIN(GND) PRTSC.VSS(GND) Q.VSS(GND) QUOTE.VSS(GND) R.VSS(GND) RANDSONG.VSS(GND) RBRACKET.VSS(GND) RIGHT.VSS(GND) S.VSS(GND) SCROLLLOCK.VSS(GND) SEMICOLON.VSS(GND) SHIFT2.DIN(GND) SHIFT.DIN(GND) SLASH.VSS(GND) SPACE.DIN(GND) T.VSS(GND) TAB.VSS(GND) U.VSS(GND) UNDERSCORE.VSS(GND) UP.VSS(GND) V.VSS(GND) VOLUMEUP.VSS(GND) VOLUMNEDOWN.VSS(GND) W.VSS(GND) WIN2.VSS(GND) WIN.VSS(GND) X.VSS(GND) Y.VSS(GND) Z.VSS(GND) ; also sheet 2
LED1: M6.DIN(DI) ; also sheet 2
LED2: M5.DIN(DI) ; also sheet 2
LED3: M4.DIN(DI) ; also sheet 2
LED4: M3.DIN(DI) ; also sheet 2
LED5: M2.DIN(DI) ; also sheet 2
LED6: CTRL1.DIN(DI) ; also sheet 2
N$1: DESC.A ESC.ALPS1(P1) ESC.MX1(P1)
N$2: DF1.A F1.ALPS1(P1) F1.MX1(P1)
N$3: DF2.A F2.ALPS1(P1) F2.MX1(P1)
N$4: DF3.A F3.ALPS1(P1) F3.MX1(P1)
N$5: DF4.A F4.ALPS1(P1) F4.MX1(P1)
N$6: DF5.A F5.ALPS1(P1) F5.MX1(P1)
N$7: DF6.A F6.ALPS1(P1) F6.MX1(P1)
N$8: DF7.A F7.ALPS1(P1) F7.MX1(P1)
N$9: DF8.A F8.ALPS1(P1) F8.MX1(P1)
N$10: DF9.A F9.ALPS1(P1) F9.MX1(P1)
N$11: DF10.A F10.ALPS1(P1) F10.MX1(P1)
N$12: DF11.A F11.ALPS1(P1) F11.MX1(P1)
N$13: DF12.A F12.ALPS1(P1) F12.MX1(P1)
N$14: DVOLUMEUP.A VOLUMEUP.ALPS1(P1) VOLUMEUP.MX1(P1)
N$15: DVOLUMNEDOWN.A VOLUMNEDOWN.ALPS1(P1) VOLUMNEDOWN.MX1(P1)
N$16: DPRTSC.A PRTSC.ALPS1(P1) PRTSC.MX1(P1)
N$17: DSCROLLLOCK.A SCROLLLOCK.ALPS1(P1) SCROLLLOCK.MX1(P1)
N$18: DPAUSE.A PAUSE.ALPS1(P1) PAUSE.MX1(P1)
N$19: BACKSONG.ALPS1(P1) BACKSONG.MX1(P1) DBACKSONG.A
N$20: DPAUSEPLAY.A PAUSEPLAY.ALPS1(P1) PAUSEPLAY.MX1(P1)
N$21: DNEXTSONG.A NEXTSONG.ALPS1(P1) NEXTSONG.MX1(P1)
N$22: DLOCK.A LOCK.ALPS1(P1) LOCK.MX1(P1)
N$23: DGRAVE.A GRAVE.ALPS1(P1) GRAVE.MX1(P1)
N$24: 1.ALPS1(P1) 1.MX1(P1) D1.A
N$25: 2.ALPS1(P1) 2.MX1(P1) D2.A
N$26: 3.ALPS1(P1) 3.MX1(P1) D3.A
N$27: 4.ALPS1(P1) 4.MX1(P1) D4.A
N$28: 5.ALPS1(P1) 5.MX1(P1) D5.A
N$29: 6.ALPS1(P1) 6.MX1(P1) D6.A
N$30: 7.ALPS1(P1) 7.MX1(P1) D7.A
N$31: 8.ALPS1(P1) 8.MX1(P1) D8.A
N$32: 9.ALPS1(P1) 9.MX1(P1) D9.A
N$33: 0.ALPS1(P1) 0.MX1(P1) D0.A
N$34: DASH.ALPS1(P1) DASH.MX1(P1) DDASH.A
N$35: DEQUAL.A EQUAL.ALPS1(P1) EQUAL.MX1(P1)
N$36: BACKSPACE.ALPS1(P1) BACKSPACE.MX1(P1) DBACKSPACE.A
N$37: DINSERT.A INSERT.ALPS1(P1) INSERT.MX1(P1)
N$38: DHOME.A HOME.ALPS1(P1) HOME.MX1(P1)
N$39: DPGUP.A PGUP.ALPS1(P1) PGUP.MX1(P1)
N$40: DNUMLOCK.A NUMLOCK.ALPS1(P1) NUMLOCK.MX1(P1)
N$41: DKP_SLASH.A KP_SLASH.ALPS1(P1) KP_SLASH.MX1(P1)
N$42: DKP_ASTERISK.A KP_ASTERISK.ALPS1(P1) KP_ASTERISK.MX1(P1)
N$43: DKP_DASH.A KP_DASH.ALPS1(P1) KP_DASH.MX1(P1)
N$44: DUNDERSCORE.A UNDERSCORE.ALPS1(P1) UNDERSCORE.MX1(P1)
N$45: DTAB.A TAB.ALPS1(P1) TAB.MX1(P1)
N$46: DQ.A Q.ALPS1(P1) Q.MX1(P1)
N$47: DW.A W.ALPS1(P1) W.MX1(P1)
N$48: DE.A E.ALPS1(P1) E.MX1(P1)
N$49: DR.A R.ALPS1(P1) R.MX1(P1)
N$50: DT.A T.ALPS1(P1) T.MX1(P1)
N$51: DY.A Y.ALPS1(P1) Y.MX1(P1)
N$52: DU.A U.ALPS1(P1) U.MX1(P1)
N$53: DI.A I.ALPS1(P1) I.MX1(P1)
N$54: DO.A O.ALPS1(P1) O.MX1(P1)
N$55: DP.A P.ALPS1(P1) P.MX1(P1)
N$56: DLBRACKET.A LBRACKET.ALPS1(P1) LBRACKET.MX1(P1)
N$57: DRBRACKET.A RBRACKET.ALPS1(P1) RBRACKET.MX1(P1)
N$58: BACKSLASH.ALPS1(P1) BACKSLASH.MX1(P1) DBACKSLASH.A
N$59: DDELETE.A DELETE.ALPS1(P1) DELETE.MX1(P1)
N$60: DEND.A END.ALPS1(P1) END.MX1(P1)
N$61: DPGDN.A PGDN.ALPS1(P1) PGDN.MX1(P1)
N$62: DKP_7.A KP_7.ALPS1(P1) KP_7.MX1(P1)
N$63: DKP_8.A KP_8.ALPS1(P1) KP_8.MX1(P1)
N$64: DKP_9.A KP_9.ALPS1(P1) KP_9.MX1(P1)
N$65: DEQUAL2.A PLUS2.ALPS1(P1) PLUS2.MX1(P1)
N$66: DKP_5.A KP_5.ALPS1(P1) KP_5.MX1(P1)
N$67: CAPSLOCK.ALPS1(P1) CAPSLOCK.MX1(P1) DCAPSLOCK.A
N$68: A.ALPS1(P1) A.MX1(P1) DA.A
N$69: DS.A S.ALPS1(P1) S.MX1(P1)
N$70: D.ALPS1(P1) D.MX1(P1) DD.A
N$71: DF.A F.ALPS1(P1) F.MX1(P1)
N$72: DG.A G.ALPS1(P1) G.MX1(P1)
N$73: DH.A H.ALPS1(P1) H.MX1(P1)
N$74: DJ.A J.ALPS1(P1) J.MX1(P1)
N$75: DK.A K.ALPS1(P1) K.MX1(P1)
N$76: DL.A L.ALPS1(P1) L.MX1(P1)
N$77: DSEMICOLON.A SEMICOLON.ALPS1(P1) SEMICOLON.MX1(P1)
N$78: DQUOTE.A QUOTE.ALPS1(P1) QUOTE.MX1(P1)
N$79: DENTER.A ENTER.ALPS1(P1) ENTER.MX1(P1)
N$80: DKP_4.A KP_4.ALPS1(P1) KP_4.MX1(P1)
N$81: DKP_52.A KP_52.ALPS1(P1) KP_52.MX1(P1)
N$82: DKP_6.A KP_6.ALPS1(P1) KP_6.MX1(P1)
N$83: DKP_62.A KP_62.ALPS1(P1) KP_62.MX1(P1)
N$84: DSHIFT.A SHIFT.ALPS1(P1) SHIFT.MX1(P1)
N$85: DZ.A Z.ALPS1(P1) Z.MX1(P1)
N$86: DX.A X.ALPS1(P1) X.MX1(P1)
N$87: C.ALPS1(P1) C.MX1(P1) DC.A
N$88: DV.A V.ALPS1(P1) V.MX1(P1)
N$89: B.ALPS1(P1) B.MX1(P1) DB.A
N$90: DN.A N.ALPS1(P1) N.MX1(P1)
N$91: DM.A M.ALPS1(P1) M.MX1(P1)
N$92: COMMA.ALPS1(P1) COMMA.MX1(P1) DCOMMA.A
N$93: DPERIOD.A PERIOD.ALPS1(P1) PERIOD.MX1(P1)
N$94: DSLASH.A SLASH.ALPS1(P1) SLASH.MX1(P1)
N$95: DSHIFT2.A SHIFT2.ALPS1(P1) SHIFT2.MX1(P1)
N$96: DUP.A UP.ALPS1(P1) UP.MX1(P1)
N$97: DKP_1.A KP_1.ALPS1(P1) KP_1.MX1(P1)
N$98: DKP_2.A KP_2.ALPS1(P1) KP_2.MX1(P1)
N$99: DKP_3.A KP_3.ALPS1(P1) KP_3.MX1(P1)
N$100: DENTER2.A ENTER2.ALPS1(P1) ENTER2.MX1(P1)
N$101: DDELETE2.A KP_DELETE2.ALPS1(P1) KP_DELETE2.MX1(P1)
N$102: CTRL.ALPS1(P1) CTRL.MX1(P1) DCTRL.A
N$103: DWIN.A WIN.ALPS1(P1) WIN.MX1(P1)
N$104: ALT.ALPS1(P1) ALT.MX1(P1) DALT.A
N$105: DSPACE.A SPACE.ALPS1(P1) SPACE.MX1(P1)
N$106: ALT2.ALPS1(P1) ALT2.MX1(P1) DALT2.A
N$107: ESC.DIN(DI) M6.DOUT(DO)
N$108: DMENU.A MENU.ALPS1(P1) MENU.MX1(P1)
N$109: CTRL2.ALPS1(P1) CTRL2.MX1(P1) DCTRL2.A
N$110: DLEFT.A LEFT.ALPS1(P1) LEFT.MX1(P1)
N$111: DDOWN.A DOWN.ALPS1(P1) DOWN.MX1(P1)
N$112: DRIGHT.A RIGHT.ALPS1(P1) RIGHT.MX1(P1)
N$113: DKP_0.A KP_0.ALPS1(P1) KP_0.MX1(P1)
N$114: DKP_DEL.A KP_DEL.ALPS1(P1) KP_DEL.MX1(P1)
N$115: BACKSPACE_1.ALPS1(P1) BACKSPACE_1.MX1(P1) DBACKSPACE_1.A
N$116: BACKSPACE.VSS(DI) EQUAL.DOUT(DO)
N$117: SHIFT2.VDD(DO) UP.DIN(DI)
N$118: ESC.DOUT(DO) F1.DIN(DI)
N$119: F1.DOUT(DO) F2.DIN(DI)
N$120: DM6.A M6.ALPS1(P1) M6.MX1(P1)
N$121: F2.DOUT(DO) F3.DIN(DI)
N$122: F3.DOUT(DO) F4.DIN(DI)
N$123: F4.DOUT(DO) F5.DIN(DI)
N$124: F5.DOUT(DO) F6.DIN(DI)
N$125: DWIN2.A WIN2.ALPS1(P1) WIN2.MX1(P1)
N$126: DM2.A M2.ALPS1(P1) M2.MX1(P1)
N$127: DM5.A M5.ALPS1(P1) M5.MX1(P1)
N$128: DM4.A M4.ALPS1(P1) M4.MX1(P1)
N$129: DM3.A M3.ALPS1(P1) M3.MX1(P1)
N$130: CTRL1.ALPS1(P1) CTRL1.MX1(P1) DM1.A
N$131: DNEXTSONG1.A RANDSONG.ALPS1(P1) RANDSONG.MX1(P1)
N$132: F6.DOUT(DO) F7.DIN(DI)
N$133: F7.DOUT(DO) F8.DIN(DI)
N$134: F8.DOUT(DO) F9.DIN(DI)
N$135: F9.DOUT(DO) F10.DIN(DI)
N$136: F10.DOUT(DO) F11.DIN(DI)
N$137: F11.DOUT(DO) F12.DIN(DI)
N$138: F12.DOUT(DO) VOLUMEUP.DIN(DI)
N$139: VOLUMEUP.DOUT(DO) VOLUMNEDOWN.DIN(DI)
N$140: PRTSC.DIN(DI) VOLUMNEDOWN.DOUT(DO)
N$141: PRTSC.DOUT(DO) SCROLLLOCK.DIN(DI)
N$142: PAUSE.DIN(DI) SCROLLLOCK.DOUT(DO)
N$143: BACKSONG.DIN(DI) PAUSE.DOUT(DO)
N$144: BACKSONG.DOUT(DO) PAUSEPLAY.DIN(DI)
N$145: NEXTSONG.DIN(DI) PAUSEPLAY.DOUT(DO)
N$146: NEXTSONG.DOUT(DO) RANDSONG.DIN(DI)
N$147: LOCK.DIN(DI) RANDSONG.DOUT(DO)
N$149: GRAVE.DIN(DI) M5.DOUT(DO)
N$150: 1.DIN(DI) GRAVE.DOUT(DO)
N$151: 1.DOUT(DO) 2.DIN(DI)
N$152: 2.DOUT(DO) 3.DIN(DI)
N$153: 3.DOUT(DO) 4.DIN(DI)
N$154: 4.DOUT(DO) 5.DIN(DI)
N$155: 5.DOUT(DO) 6.DIN(DI)
N$156: 6.DOUT(DO) 7.DIN(DI)
N$157: 7.DOUT(DO) 8.DIN(DI)
N$158: 8.DOUT(DO) 9.DIN(DI)
N$159: 0.DIN(DI) 9.DOUT(DO)
N$160: 0.DOUT(DO) DASH.DIN(DI)
N$161: DASH.DOUT(DO) EQUAL.DIN(DI)
N$164: BACKSPACE.VDD(DO) INSERT.DIN(DI)
N$165: HOME.DIN(DI) INSERT.DOUT(DO)
N$166: HOME.DOUT(DO) PGUP.DIN(DI)
N$167: NUMLOCK.DIN(DI) PGUP.DOUT(DO)
N$168: KP_SLASH.DIN(DI) NUMLOCK.DOUT(DO)
N$169: KP_ASTERISK.DIN(DI) KP_SLASH.DOUT(DO)
N$170: KP_ASTERISK.DOUT(DO) KP_DASH.DIN(DI)
N$171: KP_DASH.DOUT(DO) UNDERSCORE.DIN(DI)
N$172: M4.DOUT(DO) TAB.DIN(DI)
N$173: Q.DIN(DI) TAB.DOUT(DO)
N$174: Q.DOUT(DO) W.DIN(DI)
N$175: E.DIN(DI) W.DOUT(DO)
N$176: E.DOUT(DO) R.DIN(DI)
N$177: R.DOUT(DO) T.DIN(DI)
N$178: T.DOUT(DO) Y.DIN(DI)
N$179: U.DIN(DI) Y.DOUT(DO)
N$180: I.DIN(DI) U.DOUT(DO)
N$181: I.DOUT(DO) O.DIN(DI)
N$182: O.DOUT(DO) P.DIN(DI)
N$183: LBRACKET.DIN(DI) P.DOUT(DO)
N$184: LBRACKET.DOUT(DO) RBRACKET.DIN(DI)
N$185: BACKSLASH.DIN(DI) RBRACKET.DOUT(DO)
N$187: BACKSLASH.DOUT(DO) DELETE.DIN(DI)
N$188: DELETE.DOUT(DO) END.DIN(DI)
N$189: END.DOUT(DO) PGDN.DIN(DI)
N$190: KP_7.DIN(DI) PGDN.DOUT(DO)
N$191: KP_7.DOUT(DO) KP_8.DIN(DI)
N$192: KP_8.DOUT(DO) KP_9.DIN(DI)
N$193: KP_9.DOUT(DO) PLUS2.VSS(DI)
N$194: KP_5.DIN(DI) PLUS2.VDD(DO)
N$195: CAPSLOCK.DIN(DI) M3.DOUT(DO)
N$196: A.DIN(DI) CAPSLOCK.DOUT(DO)
N$197: A.DOUT(DO) S.DIN(DI)
N$198: D.DIN(DI) S.DOUT(DO)
N$199: D.DOUT(DO) F.DIN(DI)
N$200: F.DOUT(DO) G.DIN(DI)
N$201: G.DOUT(DO) H.DIN(DI)
N$202: H.DOUT(DO) J.DIN(DI)
N$203: J.DOUT(DO) K.DIN(DI)
N$204: K.DOUT(DO) L.DIN(DI)
N$205: L.DOUT(DO) SEMICOLON.DIN(DI)
N$206: QUOTE.DIN(DI) SEMICOLON.DOUT(DO)
N$207: ENTER.VSS(DI) QUOTE.DOUT(DO)
N$208: ENTER.VDD(DO) KP_4.DIN(DI)
N$209: ENTER2.VSS(DI) KP_3.DOUT(DO)
N$210: KP_4.DOUT(DO) KP_52.DIN(DI)
N$211: KP_6.DIN(DI) KP_52.DOUT(DO)
N$212: KP_6.DOUT(DO) KP_62.DIN(DI)
N$214: M2.DOUT(DO) SHIFT.VSS(DI)
N$215: SHIFT.VDD(DO) Z.DIN(DI)
N$216: X.DIN(DI) Z.DOUT(DO)
N$217: C.DIN(DI) X.DOUT(DO)
N$218: C.DOUT(DO) V.DIN(DI)
N$219: B.DIN(DI) V.DOUT(DO)
N$220: B.DOUT(DO) N.DIN(DI)
N$221: M.DIN(DI) N.DOUT(DO)
N$222: COMMA.DIN(DI) M.DOUT(DO)
N$223: COMMA.DOUT(DO) PERIOD.DIN(DI)
N$224: PERIOD.DOUT(DO) SLASH.DIN(DI)
N$225: SHIFT2.VSS(DI) SLASH.DOUT(DO)
N$227: KP_1.DOUT(DO) KP_2.DIN(DI)
N$228: KP_2.DOUT(DO) KP_3.DIN(DI)
N$229: ENTER2.VDD(DO) KP_DELETE2.DIN(DI)
N$230: KP_1.DIN(DI) UP.DOUT(DO)
N$232: CTRL1.DOUT(DO) CTRL.DIN(DI)
N$233: CTRL.DOUT(DO) WIN.DIN(DI)
N$234: ALT.DIN(DI) WIN.DOUT(DO)
N$235: ALT.DOUT(DO) SPACE.VSS(DI)
N$238: ALT2.DIN(DI) SPACE.VDD(DO)
N$242: ALT2.DOUT(DO) WIN2.DIN(DI)
N$243: MENU.DIN(DI) WIN2.DOUT(DO)
N$245: CTRL2.DIN(DI) MENU.DOUT(DO)
N$246: CTRL2.DOUT(DO) LEFT.DIN(DI)
N$247: KP_0.VSS(DI)
N$248: KP_0.VDD(DO) KP_DEL.DIN(DI)
N$249: BACKSPACE_1.DIN(DI) KP_DEL.DOUT(DO)
N$250: DOWN.DIN(DI) LEFT.DOUT(DO)
N$251: DOWN.DOUT(DO) RIGHT.DIN(DI)
N$252: RIGHT.DOUT(DO)
ROW1: DBACKSONG.C DESC.C DF1.C DF2.C DF3.C DF4.C DF5.C DF6.C DF7.C DF8.C DF9.C DF10.C DF11.C DF12.C DLOCK.C DM6.C DNEXTSONG1.C DNEXTSONG.C DPAUSE.C DPAUSEPLAY.C DPRTSC.C DSCROLLLOCK.C DVOLUMEUP.C DVOLUMNEDOWN.C ; also sheet 2
ROW2: D0.C D1.C D2.C D3.C D4.C D5.C D6.C D7.C D8.C D9.C DBACKSPACE.C DDASH.C DEQUAL.C DGRAVE.C DHOME.C DINSERT.C DKP_ASTERISK.C DKP_DASH.C DKP_SLASH.C DM5.C DNUMLOCK.C DPGUP.C DUNDERSCORE.C ; also sheet 2
ROW3: DBACKSLASH.C DDELETE.C DE.C DEND.C DEQUAL2.C DI.C DKP_5.C DKP_7.C DKP_8.C DKP_9.C DLBRACKET.C DM4.C DO.C DP.C DPGDN.C DQ.C DR.C DRBRACKET.C DT.C DTAB.C DU.C DW.C DY.C ; also sheet 2
ROW4: DA.C DCAPSLOCK.C DD.C DENTER.C DF.C DG.C DH.C DJ.C DK.C DKP_4.C DKP_6.C DKP_52.C DKP_62.C DL.C DM3.C DQUOTE.C DS.C DSEMICOLON.C ; also sheet 2
ROW5: DB.C DC.C DCOMMA.C DDELETE2.C DENTER2.C DKP_1.C DKP_2.C DKP_3.C DM2.C DM.C DN.C DPERIOD.C DSHIFT2.C DSHIFT.C DSLASH.C DUP.C DV.C DX.C DZ.C ; also sheet 2
ROW6: DALT2.C DALT.C DBACKSPACE_1.C DCTRL2.C DCTRL.C DDOWN.C DKP_0.C DKP_DEL.C DLEFT.C DM1.C DMENU.C DRIGHT.C DSPACE.C DWIN2.C DWIN.C ; also sheet 2
Unconnected: BACKSLASH.VDD(VCC) BACKSPACE.DOUT(VCC) BACKSPACE_1.DOUT(DO) CTRL2.VDD(VCC) ENTER.DOUT(VCC) KP_5.DOUT(DO) KP_8.VDD(VCC) KP_52.VDD(VCC) KP_62.DOUT(DO) KP_DELETE2.DOUT(DO) KP_SLASH.VDD(VCC) LOCK.DOUT(DO) UNDERSCORE.DOUT(DO)

## Sheet 2 of 2: Controller Board
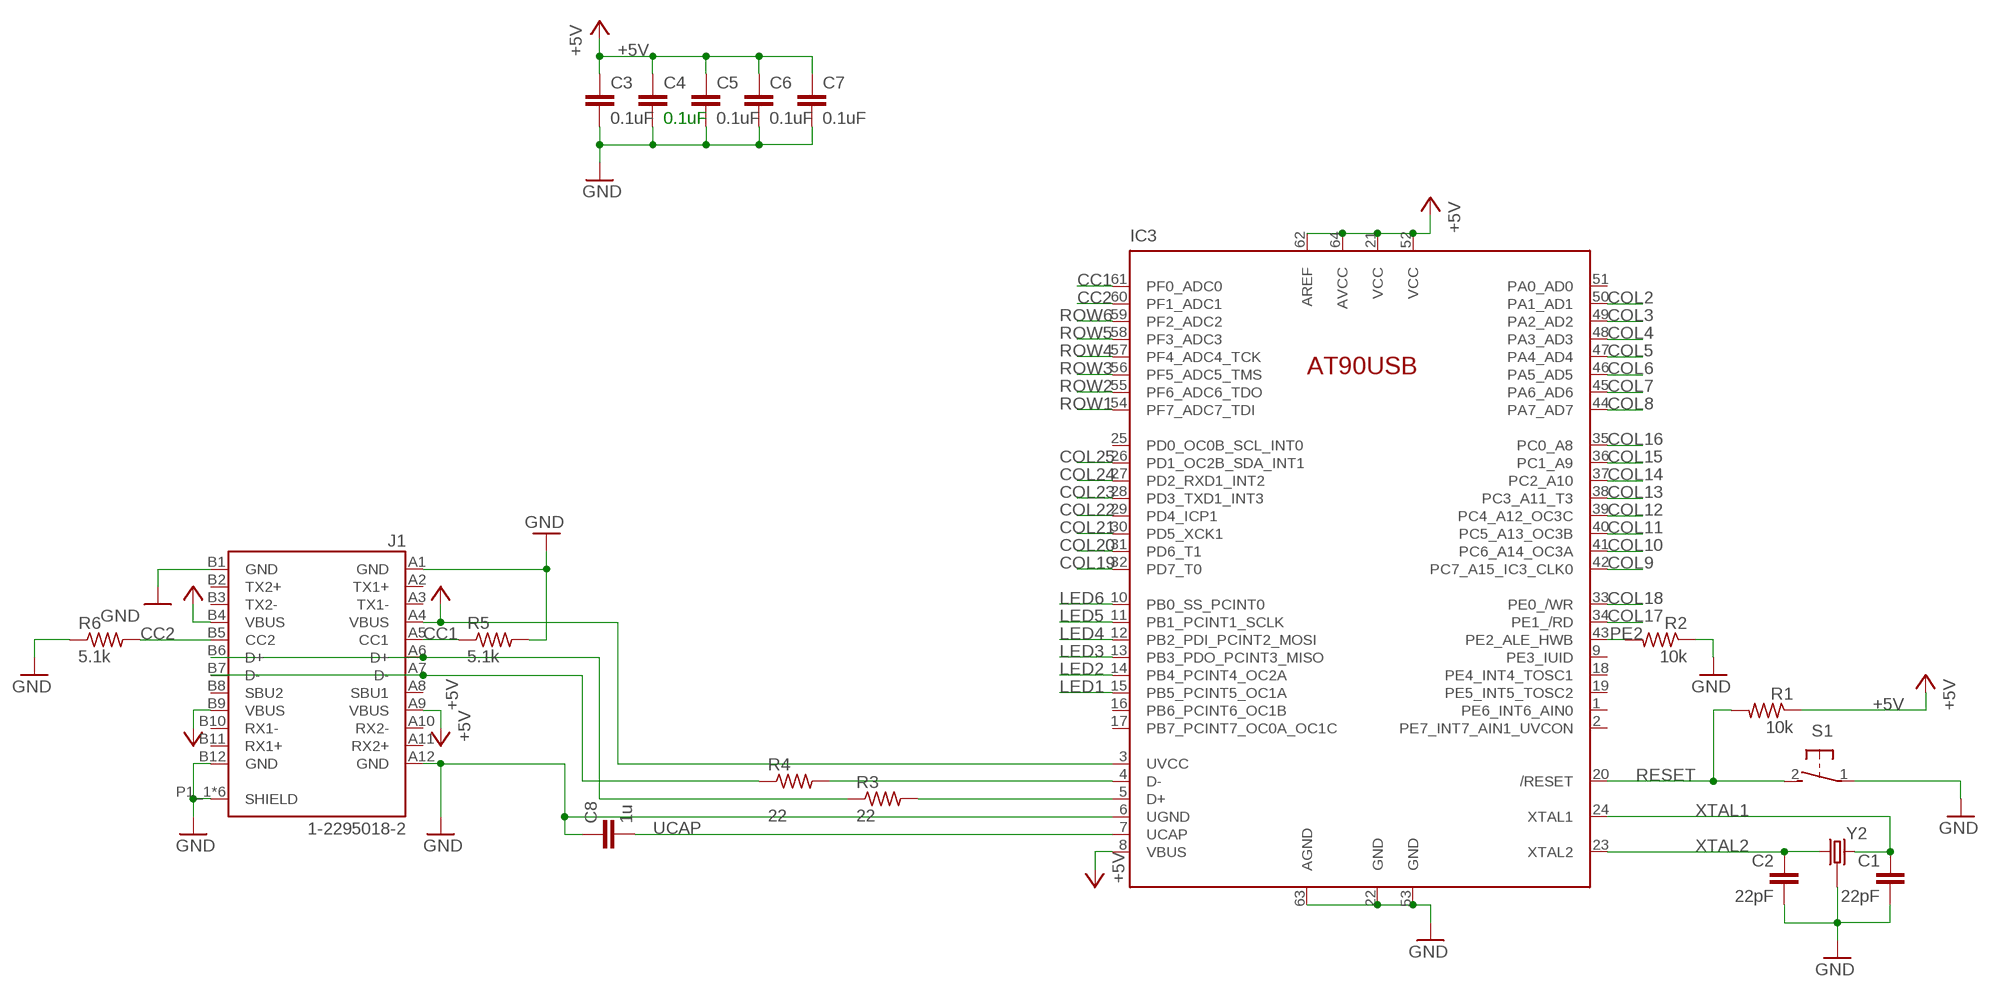
[diagram p5: schematic, sheet 2]

### Parts
C1  22pF  C-EUC0805  [C0805]
C2  22pF  C-EUC0805  [C0805]
C3  0.1uF  C-EUC0805  [C0805]
C4  0.1uF  C-EUC0805  [C0805]
C5  0.1uF  C-EUC0805  [C0805]
C6  0.1uF  C-EUC0805  [C0805]
C7  0.1uF  C-EUC0805  [C0805]
C8  1u  C-EUC0805  [C0805]
IC3  AT90USB-TQFP  [TQFP64]
J1  1-2295018-2  [TE_1-2295018-2]
R1  10k  R-US_M0805  [M0805]
R2  10k  R-US_M0805  [M0805]
R3  22  R-US_M0805  [M0805]
R4  22  R-US_M0805  [M0805]
R5  5.1k  R-US_M0805  [M0805]
R6  5.1k  R-US_M0805  [M0805]
S1  31-XX  [B3F-31XX]
Y2  CRYSTAL-GROUNDEDSMD-3.2X2.5  [CRYSTAL-SMD-3.2X2.5MM]

### Nets
+5V [POWER]: C3.1 C4.1 C5.1 C6.1 C7.1 IC3.3(UVCC) IC3.8(VBUS) IC3.21(VCC) IC3.52(VCC) IC3.62(AREF) IC3.64(AVCC) J1.A4(VBUS) J1.A9(VBUS) J1.B4(VBUS) J1.B9(VBUS) R1.1 ; also sheet 1
CC1: IC3.61(PF0_ADC0) J1.A5(CC1) R5.1
CC2: IC3.60(PF1_ADC1) J1.B5(CC2) R6.2
COL2: IC3.50(PA1_AD1) ; also sheet 1
COL3: IC3.49(PA2_AD2) ; also sheet 1
COL4: IC3.48(PA3_AD3) ; also sheet 1
COL5: IC3.47(PA4_AD4) ; also sheet 1
COL6: IC3.46(PA5_AD5) ; also sheet 1
COL7: IC3.45(PA6_AD6) ; also sheet 1
COL8: IC3.44(PA7_AD7) ; also sheet 1
COL9: IC3.42(PC7_A15_IC3_CLK0) ; also sheet 1
COL10: IC3.41(PC6_A14_OC3A) ; also sheet 1
COL11: IC3.40(PC5_A13_OC3B) ; also sheet 1
COL12: IC3.39(PC4_A12_OC3C) ; also sheet 1
COL13: IC3.38(PC3_A11_T3) ; also sheet 1
COL14: IC3.37(PC2_A10) ; also sheet 1
COL15: IC3.36(PC1_A9) ; also sheet 1
COL16: IC3.35(PC0_A8) ; also sheet 1
COL17: IC3.34(PE1_/RD) ; also sheet 1
COL18: IC3.33(PE0_/WR) ; also sheet 1
COL19: IC3.32(PD7_T0) ; also sheet 1
COL20: IC3.31(PD6_T1) ; also sheet 1
COL21: IC3.30(PD5_XCK1) ; also sheet 1
COL22: IC3.29(PD4_ICP1) ; also sheet 1
COL23: IC3.28(PD3_TXD1_INT3) ; also sheet 1
COL24: IC3.27(PD2_RXD1_INT2) ; also sheet 1
COL25: IC3.26(PD1_OC2B_SDA_INT1) ; also sheet 1
D+32U: IC3.5(D+) R3.2
D+USB: J1.A6(D+) J1.B6(D+) R3.1
D-32U4: IC3.4(D-) R4.2
D-USB: J1.A7(D-) J1.B7(D-) R4.1
GND [POWER]: C1.2 C2.2 C3.2 C4.2 C5.2 C6.2 C7.2 C8.1 IC3.6(UGND) IC3.22(GND) IC3.53(GND) IC3.63(AGND) J1.A1(GND) J1.A12(GND) J1.B1(GND) J1.B12(GND) J1.P1_1(SHIELD) J1.P1_2(SHIELD) J1.P2_1(SHIELD) J1.P2_2(SHIELD) J1.P4(SHIELD) J1.P5(SHIELD) R2.1 R5.2 R6.1 S1.1(P) Y2.2 Y2.4 ; also sheet 1
LED1: IC3.15(PB5_PCINT5_OC1A) ; also sheet 1
LED2: IC3.14(PB4_PCINT4_OC2A) ; also sheet 1
LED3: IC3.13(PB3_PDO_PCINT3_MISO) ; also sheet 1
LED4: IC3.12(PB2_PDI_PCINT2_MOSI) ; also sheet 1
LED5: IC3.11(PB1_PCINT1_SCLK) ; also sheet 1
LED6: IC3.10(PB0_SS_PCINT0) ; also sheet 1
PE2: IC3.43(PE2_ALE_HWB) R2.2
RESET: IC3.20(/RESET) R1.2 S1.2(S)
ROW1: IC3.54(PF7_ADC7_TDI) ; also sheet 1
ROW2: IC3.55(PF6_ADC6_TDO) ; also sheet 1
ROW3: IC3.56(PF5_ADC5_TMS) ; also sheet 1
ROW4: IC3.57(PF4_ADC4_TCK) ; also sheet 1
ROW5: IC3.58(PF3_ADC3) ; also sheet 1
ROW6: IC3.59(PF2_ADC2) ; also sheet 1
UCAP: C8.2 IC3.7(UCAP)
XTAL1: C1.1 IC3.24(XTAL1) Y2.1
XTAL2: C2.1 IC3.23(XTAL2) Y2.3
Unconnected: IC3.1(PE6_INT6_AIN0) IC3.2(PE7_INT7_AIN1_UVCON) IC3.9(PE3_IUID) IC3.16(PB6_PCINT6_OC1B) IC3.17(PB7_PCINT7_OC0A_OC1C) IC3.18(PE4_INT4_TOSC1) IC3.19(PE5_INT5_TOSC2) IC3.25(PD0_OC0B_SCL_INT0) IC3.51(PA0_AD0) J1.A2(TX1+) J1.A3(TX1-) J1.A8(SBU1) J1.A10(RX2-) J1.A11(RX2+) J1.B2(TX2+) J1.B3(TX2-) J1.B8(SBU2) J1.B10(RX1-) J1.B11(RX1+)

## Library data of the parts
0 1-9 A ALT ALT2 B BACKSLASH BACKSONG BACKSPACE BACKSPACE_1 C CAPSLOCK COMMA CTRL CTRL1 CTRL2 D DASH DELETE DOWN E END ENTER ENTER2 EQUAL ESC F F1-F12 G GRAVE H HOME I INSERT J K KP_0 KP_1-KP_9 KP_52 KP_62 KP_ASTERISK KP_DASH KP_DEL KP_DELETE2 KP_SLASH L LBRACKET LEFT LOCK M M2-M6 MENU N NEXTSONG NUMLOCK O P PAUSE PAUSEPLAY PERIOD PGDN PGUP PLUS2 PRTSC Q QUOTE R RANDSONG RBRACKET RIGHT S SCROLLLOCK SEMICOLON SHIFT SHIFT2 SLASH SPACE T TAB U UNDERSCORE UP V VOLUMEUP VOLUMNEDOWN W WIN WIN2 X Y Z = Keyboard:KEYSWITCH-RGBSMDLED
C1-C8 = rcl:C-EU: CAPACITOR, European symbol; SPICEPREFIX: C
D0 D1-D9 DA DALT DALT2 DB DBACKSLASH DBACKSONG DBACKSPACE DBACKSPACE_1 DC DCAPSLOCK DCOMMA DCTRL DCTRL2 DD DDASH DDELETE DDELETE2 DDOWN DE DEND DENTER DENTER2 DEQUAL DEQUAL2 DESC DF DF1-DF12 DG DGRAVE DH DHOME DI DINSERT DJ DK DKP_0 DKP_1-DKP_9 DKP_52 DKP_62 DKP_ASTERISK DKP_DASH DKP_DEL DKP_SLASH DL DLBRACKET DLEFT DLOCK DM DM1-DM6 DMENU DN DNEXTSONG DNEXTSONG1 DNUMLOCK DO DP DPAUSE DPAUSEPLAY DPERIOD DPGDN DPGUP DPRTSC DQ DQUOTE DR DRBRACKET DRIGHT DS DSCROLLLOCK DSEMICOLON DSHIFT DSHIFT2 DSLASH DSPACE DT DTAB DU DUNDERSCORE DUP DV DVOLUMEUP DVOLUMNEDOWN DW DWIN DWIN2 DX DY DZ = Components:DIODE: Standard 1N4148 diode
IC3 = controller-micro_atmel_jd:AT90USB
J1 = 1-2295018-2:1-2295018-2: SPLASH PROOF USB TYPE C REC, DUAL SMT; Tape/Reel of 900; AVAILABILITY: Unavailable; COMMENT: 1-2295018-2; DESCRIPTION: USB TYPE C, REC OFFSET 0.65MM DUAL SMT; MF: TE Connectivity; MP: 1-2295018-2; PACKAGE: None; PRICE: None; TE_PURCHASE_URL: https://www.te.com/usa-en/product-1-2295018-2.html?te_bu=Cor&te_type=disp&te_campaign=seda_glo_cor-seda-global-disp-prtnr-fy19-seda-model-bom-cta_sma-317_1&elqCampaignId=32493
R1-R6 = rcl:R-US_: RESISTOR, American symbol; SPICEPREFIX: R
S1 = switch-omron:31-XX: OMRON SWITCH; MPN: B3F-3100; OC_FARNELL: 959704; OC_NEWARK: 36M3582
Y2 = SparkFun-Clocks:CRYSTAL-GROUNDED: Crystals w/ Ground Pin (Generic) These are passive quartz crystals, which can be used as a clock source for a microcontroller. Crystal's are usually two-terminal devices. A third terminal may be optionally connected to ground, as recommended by the manufaturer.

## Net classes
0 default: width 0.2 mm
1 POWER: width 0.406 mm